# EAGLE schematic snowmaker_V1.0_for_eagle7.5 (EAGLE 7.7.0)

## Sheet 1 of 5: 主控、通讯部分
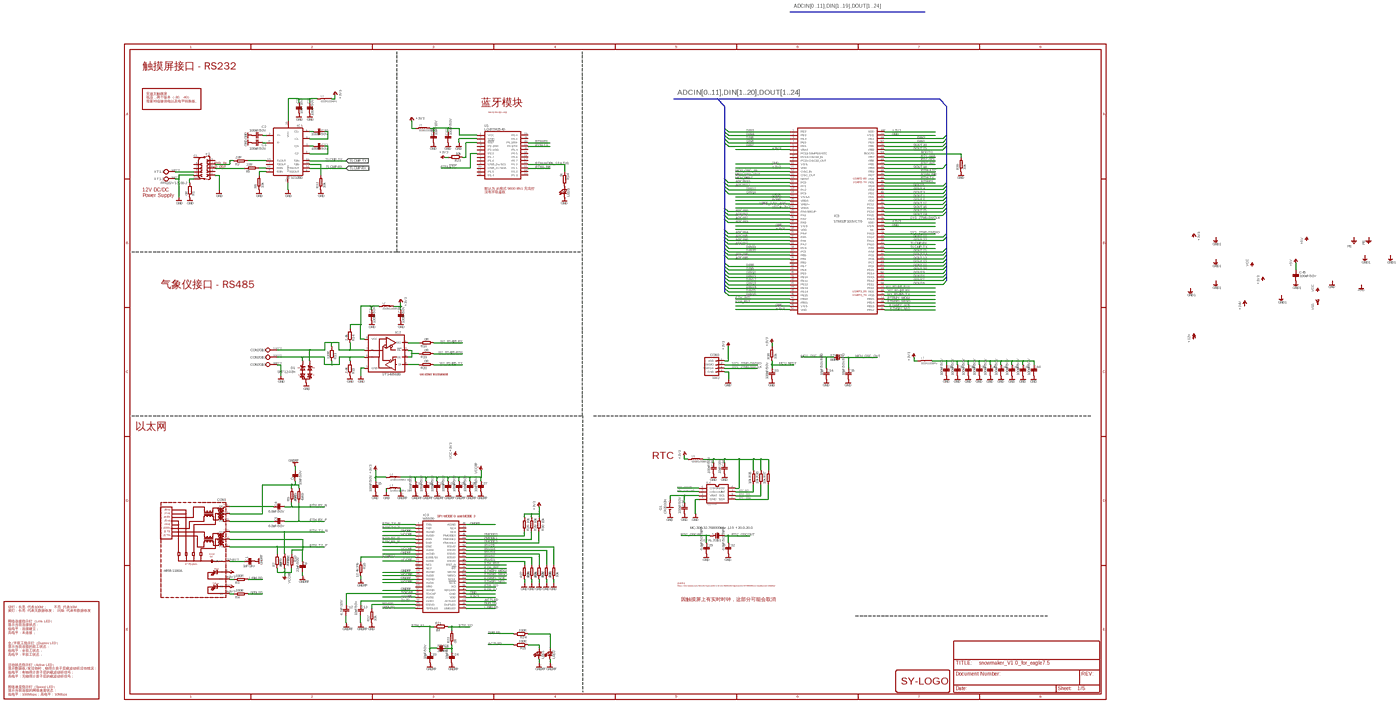
[diagram p0: schematic, sheet 1, overview]
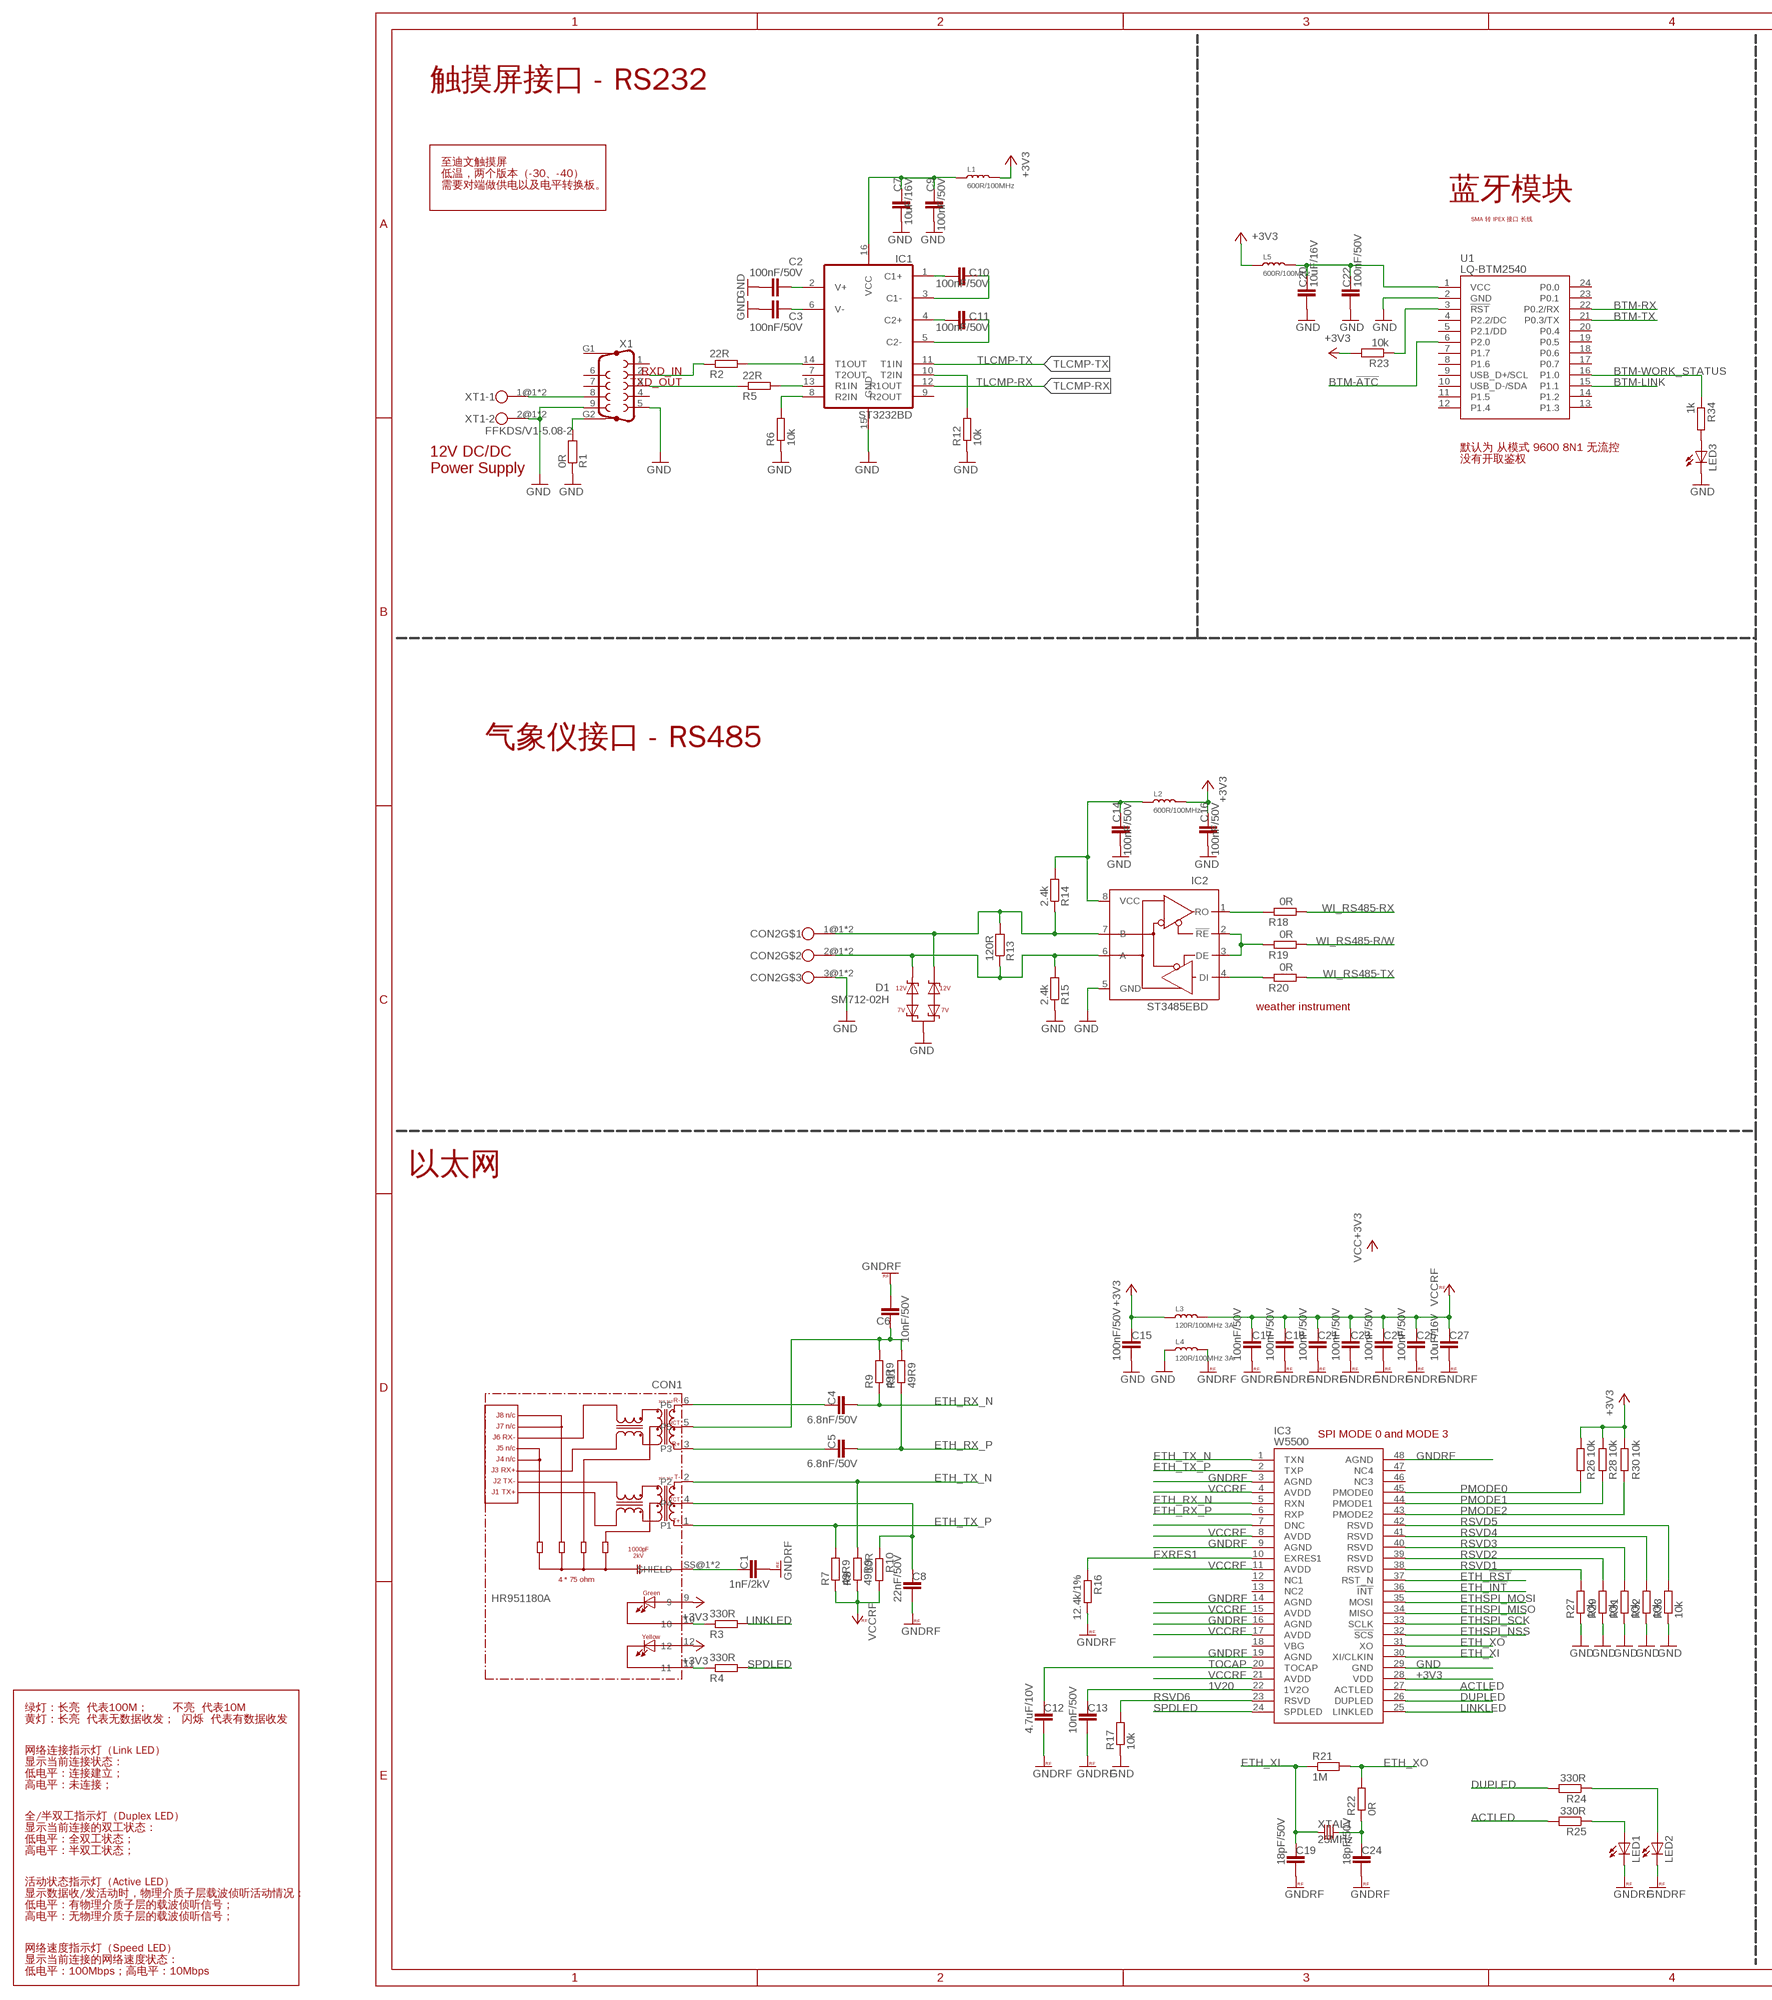
[diagram p1: schematic, sheet 1, part 1 of 4]
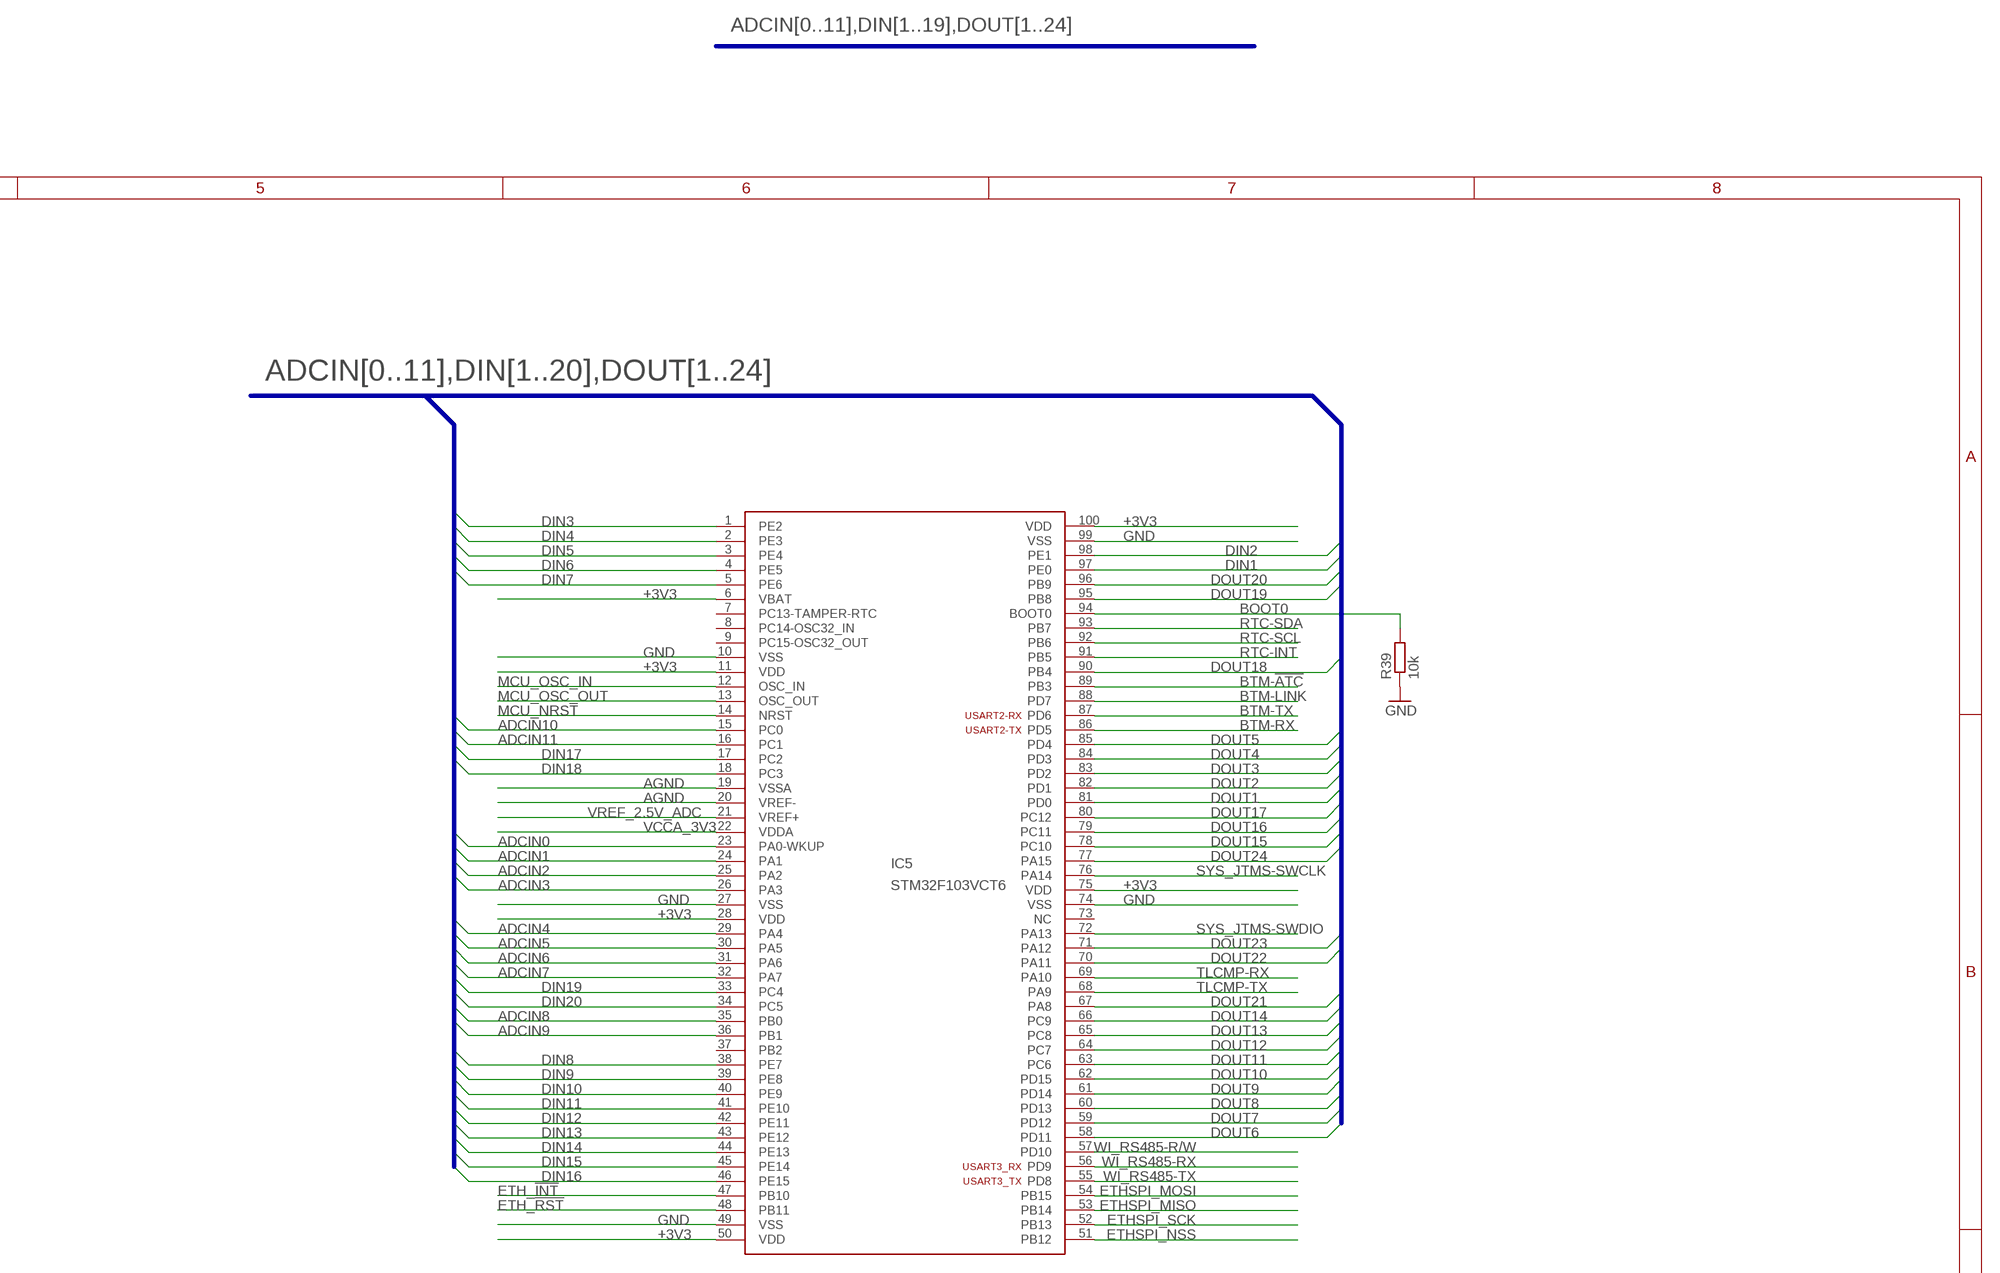
[diagram p2: schematic, sheet 1, part 2 of 4]
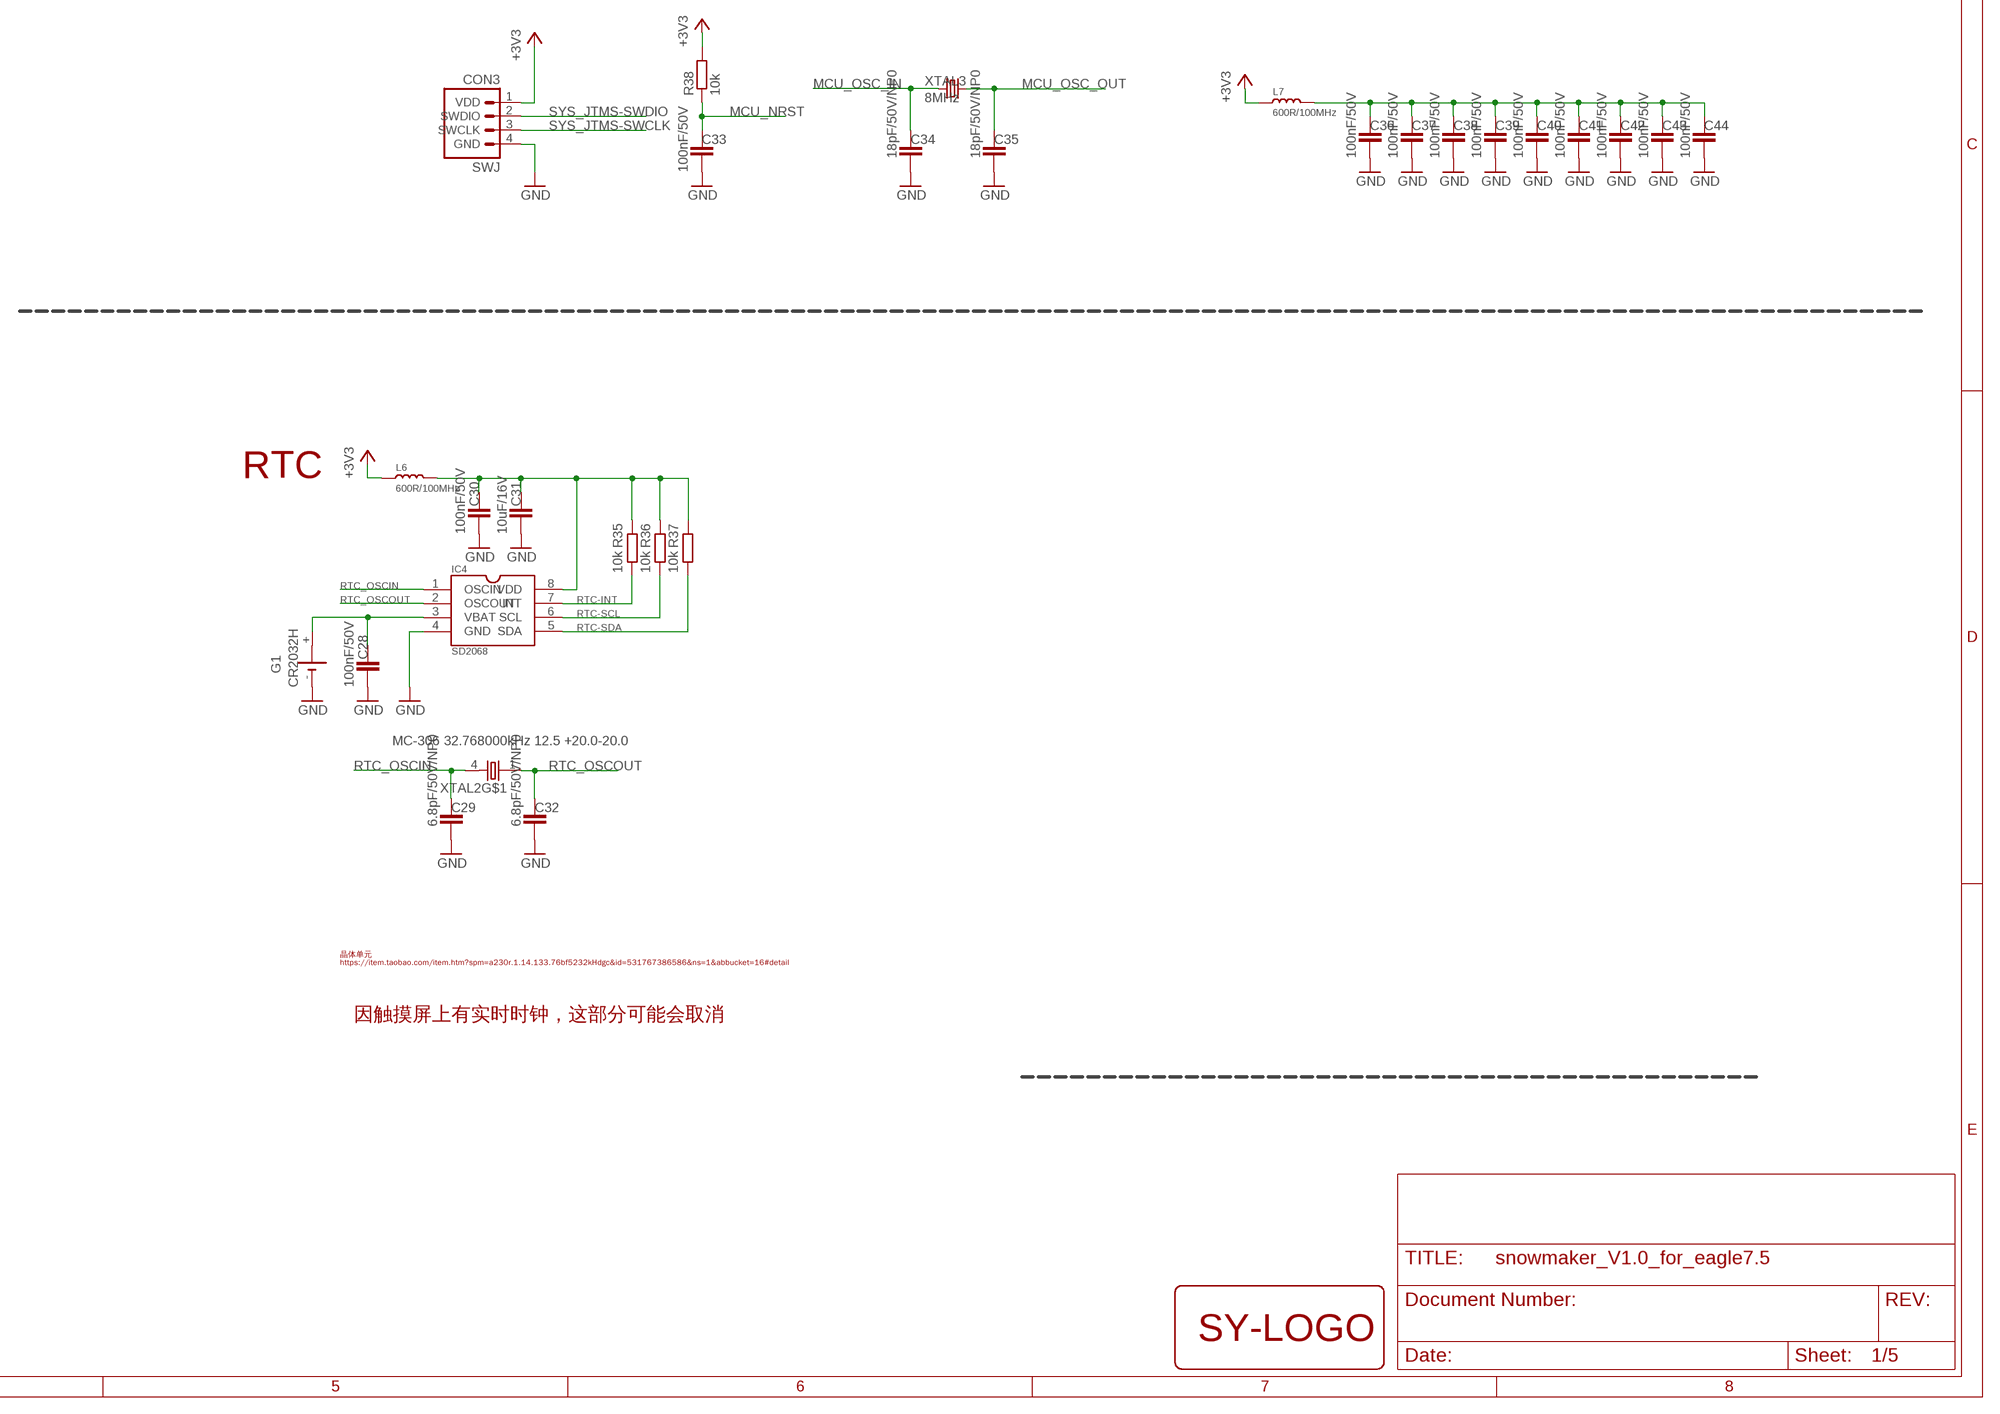
[diagram p3: schematic, sheet 1, part 3 of 4]
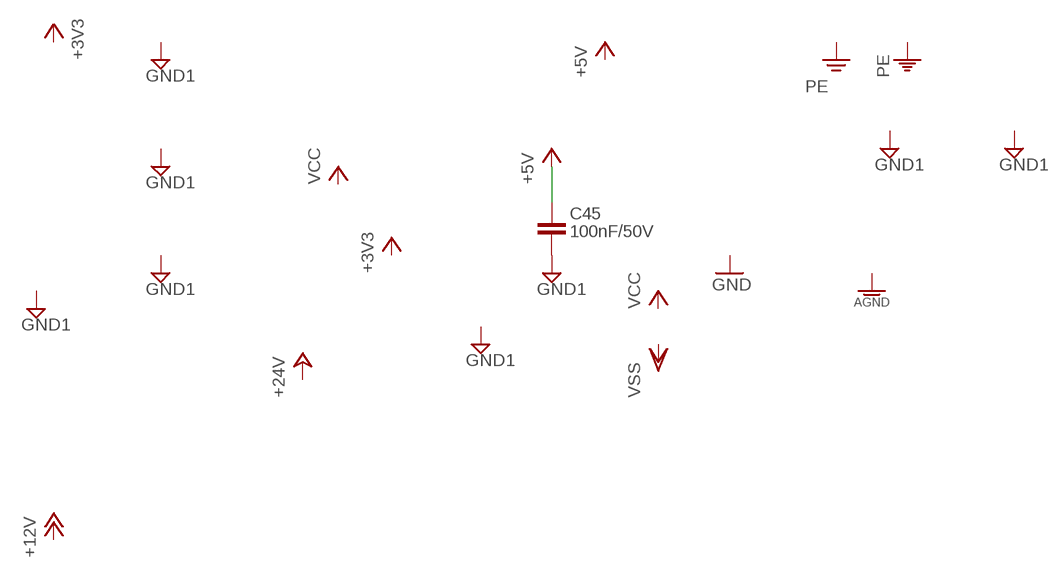
[diagram p4: schematic, sheet 1, part 4 of 4]

### Parts
C1  1nF/2kV  C1206  [C1206]
C2  100nF/50V  C0603  [C0603]
C3  100nF/50V  C0603  [C0603]
C4  6.8nF/50V  C0603  [C0603]
C5  6.8nF/50V  C0603  [C0603]
C6  10nF/50V  C0603  [C0603]
C7  10uF/16V  C0603  [C0603]
C8  22nF/50V  C0603  [C0603]
C9  100nF/50V  C0603  [C0603]
C10  100nF/50V  C0603  [C0603]
C11  100nF/50V  C0603  [C0603]
C12  4.7uF/10V  C0603  [C0603]
C13  10nF/50V  C0603  [C0603]
C14  100nF/50V  C0603  [C0603]
C15  100nF/50V  C0603  [C0603]
C16  100nF/50V  C0603  [C0603]
C17  100nF/50V  C0603  [C0603]
C18  100nF/50V  C0603  [C0603]
C19  18pF/50V  C0603  [C0603]
C20  10uF/16V  C0603  [C0603]
C21  100nF/50V  C0603  [C0603]
C22  100nF/50V  C0603  [C0603]
C23  100nF/50V  C0603  [C0603]
C24  18pF/50V  C0603  [C0603]
C25  100nF/50V  C0603  [C0603]
C26  100nF/50V  C0603  [C0603]
C27  10uF/16V  C0603  [C0603]
C28  100nF/50V  C0603  [C0603]
C29  6.8pF/50V/NP0  C0603  [C0603]
C30  100nF/50V  C0603  [C0603]
C31  10uF/16V  C0603  [C0603]
C32  6.8pF/50V/NP0  C0603  [C0603]
C33  100nF/50V  C0603  [C0603]
C34  18pF/50V/NP0  C0603  [C0603]
C35  18pF/50V/NP0  C0603  [C0603]
C36  100nF/50V  C0603  [C0603]
C37  100nF/50V  C0603  [C0603]
C38  100nF/50V  C0603  [C0603]
C39  100nF/50V  C0603  [C0603]
C40  100nF/50V  C0603  [C0603]
C41  100nF/50V  C0603  [C0603]
C42  100nF/50V  C0603  [C0603]
C43  100nF/50V  C0603  [C0603]
C44  100nF/50V  C0603  [C0603]
C45  100nF/50V  C0603  [C0603]
CON1  HR951180A  [HY951180A]
CON2  FFKDS/V1-5.08-3  [FFKDS/V1-5.08-3]
CON3  SWJ  [PINHEAD-4P]
D1  SM712-02H  [SOT23-3]
G1  CR2032H  [CR2032H]
IC1  ST3232BD  [SO16]
IC2  ST3485EBD  [SO08]
IC3  W5500  [LQFP48_7X7_0.5P]
IC4  SD2068  [SOIC-8]
IC5  STM32F103VCT6  [LQFP100_14X14MM]
L1  600R/100MHz  INDUCTOR/FERRITE-BEAD'0603'  [L0603]
L2  600R/100MHz  INDUCTOR/FERRITE-BEAD'0603'  [L0603]
L3  120R/100MHz 3A  INDUCTOR/FERRITE-BEAD'0603'  [L0603]
L4  120R/100MHz 3A  INDUCTOR/FERRITE-BEAD'0603'  [L0603]
L5  600R/100MHz  INDUCTOR/FERRITE-BEAD'0603'  [L0603]
L6  600R/100MHz  INDUCTOR/FERRITE-BEAD'0603'  [L0603]
L7  600R/100MHz  INDUCTOR/FERRITE-BEAD'0603'  [L0603]
LED1  LEDSML0805  [SML0805]
LED2  LEDSML0805  [SML0805]
LED3  LED0805  [LED0805]
LOGO1  SY-LOGO_BOTTOM  [SY-LOGO_BOTTOM]
R1  0R  R1206  [R1206]
R2  22R  R0603  [R0603]
R3  330R  R0603  [R0603]
R4  330R  R0603  [R0603]
R5  22R  R0603  [R0603]
R6  10k  R0603  [R0603]
R7  49R9  R0603  [R0603]
R8  49R9  R0603  [R0603]
R9  49R9  R0603  [R0603]
R10  10R  R0603  [R0603]
R11  49R9  R0603  [R0603]
R12  10k  R0603  [R0603]
R13  120R  R1206  [R1206]
R14  2.4k  R1206  [R1206]
R15  2.4k  R1206  [R1206]
R16  12.4k/1%  R0603  [R0603]
R17  10k  R0603  [R0603]
R18  0R  R0603  [R0603]
R19  0R  R0603  [R0603]
R20  0R  R0603  [R0603]
R21  1M  R0603  [R0603]
R22  0R  R0603  [R0603]
R23  10k  R0603  [R0603]
R24  330R  R0603  [R0603]
R25  330R  R0603  [R0603]
R26  10k  R0603  [R0603]
R27  10k  R0603  [R0603]
R28  10k  R0603  [R0603]
R29  10k  R0603  [R0603]
R30  10k  R0603  [R0603]
R31  10k  R0603  [R0603]
R32  10k  R0603  [R0603]
R33  10k  R0603  [R0603]
R34  1k  R0603  [R0603]
R35  10k  R0603  [R0603]
R36  10k  R0603  [R0603]
R37  10k  R0603  [R0603]
R38  10k  R0603  [R0603]
R39  10k  R0603  [R0603]
U1  LQ-BTM2540  [LQ-BTM2540]
X1  F09VP  [F09VP]
XT1  FFKDS/V1-5.08-2  [FFKDS/V1-5.08-2]
XTAL1  25MHz  CRYSTALSM49  [SM49]
XTAL2  MC-306 32.768000kHz 12.5 +20.0-20.0  MC-306  [MC306]
XTAL3  8MHz  CRYSTALSM49  [SM49]

### Nets
1V20: C13.1 IC3.22(1V2O)
+3V3: C15.1 C16.1 CON1.9 CON1.12 CON3.1(VDD) IC3.28(VDD) IC5.6(VBAT) IC5.11(VDD) IC5.28(VDD) IC5.50(VDD) IC5.75(VDD) IC5.100(VDD) L1.2 L2.2 L3.1 L5.1 L6.1 L7.1 R23.2 R26.2 R28.2 R30.2 R38.2 ; also sheet 3
+5V: C45.1
ACTLED: IC3.27(ACTLED) R25.2
ADCIN0: IC5.23(PA0-WKUP) ; also sheet 4
ADCIN1: IC5.24(PA1) ; also sheet 4
ADCIN2: IC5.25(PA2) ; also sheet 4
ADCIN3: IC5.26(PA3) ; also sheet 4
ADCIN4: IC5.29(PA4) ; also sheet 4
ADCIN5: IC5.30(PA5) ; also sheet 4
ADCIN6: IC5.31(PA6) ; also sheet 4
ADCIN7: IC5.32(PA7) ; also sheet 4
ADCIN8: IC5.35(PB0) ; also sheet 4
ADCIN9: IC5.36(PB1) ; also sheet 4
ADCIN10: IC5.15(PC0) ; also sheet 4
ADCIN11: IC5.16(PC1) ; also sheet 4
AGND: IC5.19(VSSA) IC5.20(VREF-) ; also sheet 4
BOOT0: IC5.94(BOOT0) R39.2
BTM-!ATC: IC5.89(PB3) U1.6(P2.0)
BTM-LINK: IC5.88(PD7) U1.15(P1.1)
BTM-RX: IC5.86(PD5) U1.22(P0.2/RX)
BTM-TX: IC5.87(PD6) U1.21(P0.3/TX)
BTM-WORK_STATUS: R34.1 U1.16(P1.0)
DIN1: IC5.97(PE0) ; also sheet 3
DIN2: IC5.98(PE1) ; also sheet 3
DIN3: IC5.1(PE2) ; also sheet 3
DIN4: IC5.2(PE3) ; also sheet 3
DIN5: IC5.3(PE4) ; also sheet 3
DIN6: IC5.4(PE5) ; also sheet 3
DIN7: IC5.5(PE6) ; also sheet 3
DIN8: IC5.38(PE7) ; also sheet 3
DIN9: IC5.39(PE8) ; also sheet 3
DIN10: IC5.40(PE9) ; also sheet 3
DIN11: IC5.41(PE10) ; also sheet 3
DIN12: IC5.42(PE11) ; also sheet 3
DIN13: IC5.43(PE12) ; also sheet 3
DIN14: IC5.44(PE13) ; also sheet 3
DIN15: IC5.45(PE14) ; also sheet 3
DIN16: IC5.46(PE15) ; also sheet 3
DIN17: IC5.17(PC2) ; also sheet 3
DIN18: IC5.18(PC3) ; also sheet 3
DIN19: IC5.33(PC4) ; also sheet 3
DIN20: IC5.34(PC5) ; also sheet 3
DOUT1: IC5.81(PD0) ; also sheet 2
DOUT2: IC5.82(PD1) ; also sheet 2
DOUT3: IC5.83(PD2) ; also sheet 2
DOUT4: IC5.84(PD3) ; also sheet 2
DOUT5: IC5.85(PD4) ; also sheet 2
DOUT6: IC5.58(PD11) ; also sheet 2
DOUT7: IC5.59(PD12) ; also sheet 2
DOUT8: IC5.60(PD13) ; also sheet 2
DOUT9: IC5.61(PD14) ; also sheet 2
DOUT10: IC5.62(PD15) ; also sheet 2
DOUT11: IC5.63(PC6) ; also sheet 2
DOUT12: IC5.64(PC7) ; also sheet 2
DOUT13: IC5.65(PC8) ; also sheet 2
DOUT14: IC5.66(PC9) ; also sheet 2
DOUT15: IC5.78(PC10) ; also sheet 2
DOUT16: IC5.79(PC11) ; also sheet 2
DOUT17: IC5.80(PC12) ; also sheet 2
DOUT18: IC5.90(PB4) ; also sheet 2
DOUT19: IC5.95(PB8) ; also sheet 2
DOUT20: IC5.96(PB9) ; also sheet 2
DOUT21: IC5.67(PA8) ; also sheet 2
DOUT22: IC5.70(PA11) ; also sheet 2
DOUT23: IC5.71(PA12) ; also sheet 2
DOUT24: IC5.77(PA15) ; also sheet 2
DUPLED: IC3.26(DUPLED) R24.2
ETH_!INT: IC3.36(!INT) IC5.47(PB10)
ETH_!RST: IC3.37(RST_N) IC5.48(PB11)
ETH_RX_N: C4.2 IC3.5(RXN) R9.1
ETH_RX_P: C5.2 IC3.6(RXP) R11.1
ETH_RXC_N: C4.1 CON1.6
ETH_RXC_P: C5.1 CON1.3
ETH_TX_N: CON1.2 IC3.1(TXN) R8.2
ETH_TX_P: CON1.1 IC3.2(TXP) R7.2
ETH_XI: C19.1 IC3.30(XI/CLKIN) R21.1 XTAL1.1
ETH_XO: IC3.31(XO) R21.2 R22.2
ETHSPI_MISO: IC3.34(MISO) IC5.53(PB14)
ETHSPI_MOSI: IC3.35(MOSI) IC5.54(PB15)
ETHSPI_NSS: IC3.32(!SCS) IC5.51(PB12)
ETHSPI_SCK: IC3.33(SCLK) IC5.52(PB13)
EXRES1: IC3.10(EXRES1) R16.1
GND: C2.2 C3.2 C7.2 C9.2 C14.2 C15.2 C16.2 C20.2 C22.2 C28.2 C29.2 C30.2 C31.2 C32.2 C33.2 C34.2 C35.2 C36.2 C37.2 C38.2 C39.2 C40.2 C41.2 C42.2 C43.2 C44.2 CON2.3@1 CON2.3@2 CON3.4(GND) D1.3 G1.- IC1.15(GND) IC2.5(GND) IC3.29(GND) IC4.4(GND) IC5.10(VSS) IC5.27(VSS) IC5.49(VSS) IC5.74(VSS) IC5.99(VSS) L4.1 LED3.C R1.1 R6.1 R12.1 R15.1 R17.1 R27.1 R29.1 R31.1 R32.1 R33.1 R39.1 U1.2(GND) X1.5 X1.9 XT1.2@1 XT1.2@2 ; also sheet 2,3,4
GND1: C45.2 ; also sheet 2
GNDRF: C1.2 C6.2 C8.2 C12.2 C13.2 C17.2 C18.2 C19.2 C21.2 C23.2 C24.2 C25.2 C26.2 C27.2 IC3.3(AGND) IC3.9(AGND) IC3.14(AGND) IC3.16(AGND) IC3.19(AGND) IC3.48(AGND) L4.2 LED1.C LED2.C R16.2
LINKLED: IC3.25(LINKLED) R3.2
MCU_NRST: C33.1 IC5.14(NRST) R38.1
MCU_OSC_IN: C34.1 IC5.12(OSC_IN) XTAL3.1
MCU_OSC_OUT: C35.1 IC5.13(OSC_OUT) XTAL3.2
N$169: C24.1 R22.1 XTAL1.2
N$170: CON1.10 R3.1
N$171: C10.2 IC1.1(C1+)
N$172: C11.2 IC1.4(C2+)
N$173: C2.1 IC1.2(V+)
N$174: C3.1 IC1.6(V-)
N$175: C10.1 IC1.3(C1-)
N$176: C11.1 IC1.5(C2-)
N$177: IC2.4(DI) R20.1
N$178: CON1.11 R4.1
N$179: IC1.10(T2IN) R12.2
N$180: IC2.2(!RE) IC2.3(DE) R19.1
N$197: CON2.2@1 CON2.2@2 D1.1 IC2.6(A) R13.1 R15.2
N$198: IC1.14(T1OUT) R2.2
N$199: R2.1 X1.2
N$200: C1.1 CON1.SS@1(SHIELD) CON1.SS@2(SHIELD)
N$217: C8.1 CON1.4 R10.1
N$218: C6.1 CON1.5 R9.2 R11.2
N$219: CON2.1@1 CON2.1@2 D1.2 IC2.7(B) R13.2 R14.1
N$220: R5.1 X1.3
N$222: IC3.7(DNC)
N$224: LED1.A R25.1
N$225: LED2.A R24.1
N$226: IC1.13(R1IN) R5.2
N$227: IC1.8(R2IN) R6.2
N$295: LED3.A R34.2
N$296: C28.1 G1.+ IC4.3(VBAT)
N$297: R23.1 U1.3(!RST)
N$298: C7.1 C9.1 IC1.16(VCC) L1.1
N$299: C20.1 C22.1 L5.2 U1.1(VCC)
N$300: C36.1 C37.1 C38.1 C39.1 C40.1 C41.1 C42.1 C43.1 C44.1 L7.2
N$301: C14.1 IC2.8(VCC) L2.1 R14.2
N$302: R1.2 X1.G2
N$303: C30.1 C31.1 IC4.8(VDD) L6.2 R35.1 R36.1 R37.1
N$304: X1.8 XT1.1@1 XT1.1@2
PMODE0: IC3.45(PMODE0) R26.1
PMODE1: IC3.44(PMODE1) R28.1
PMODE2: IC3.43(PMODE2) R30.1
RSVD1: IC3.38(RSVD) R27.2
RSVD2: IC3.39(RSVD) R29.2
RSVD3: IC3.40(RSVD) R31.2
RSVD4: IC3.41(RSVD) R32.2
RSVD5: IC3.42(RSVD) R33.2
RSVD6: IC3.23(RSVD) R17.2
RTC-INT: IC4.7(INT) IC5.91(PB5) R35.2
RTC-SCL: IC4.6(SCL) IC5.92(PB6) R36.2
RTC-SDA: IC4.5(SDA) IC5.93(PB7) R37.2
RTC_OSCIN: C29.1 IC4.1(OSCIN) XTAL2.4
RTC_OSCOUT: C32.1 IC4.2(OSCOUT) XTAL2.1
RX-485: IC2.1(RO) R18.1
SPDLED: IC3.24(SPDLED) R4.2
SYS_JTMS-SWCLK: CON3.3(SWCLK) IC5.76(PA14)
SYS_JTMS-SWDIO: CON3.2(SWDIO) IC5.72(PA13)
TLCMP-RX: IC1.12(R1OUT) IC5.69(PA10)
TLCMP-TX: IC1.11(T1IN) IC5.68(PA9)
TOCAP: C12.1 IC3.20(TOCAP)
VCCA_3V3: IC5.22(VDDA) ; also sheet 4
VCCRF: C17.1 C18.1 C21.1 C23.1 C25.1 C26.1 C27.1 IC3.4(AVDD) IC3.8(AVDD) IC3.11(AVDD) IC3.15(AVDD) IC3.17(AVDD) IC3.21(AVDD) L3.2 R7.1 R8.1 R10.2
VREF_2.5V_ADC: IC5.21(VREF+) ; also sheet 4
WI_RS485-R/W: IC5.57(PD10) R19.2
WI_RS485-RX: IC5.56(PD9) R18.2
WI_RS485-TX: IC5.55(PD8) R20.2
Unconnected: G1.+@1(+) IC1.7(T2OUT) IC1.9(R2OUT) IC3.12(NC1) IC3.13(NC2) IC3.18(VBG) IC3.46(NC3) IC3.47(NC4) IC5.7(PC13-TAMPER-RTC) IC5.8(PC14-OSC32_IN) IC5.9(PC15-OSC32_OUT) IC5.37(PB2) IC5.73(NC) U1.4(P2.2/DC) U1.5(P2.1/DD) U1.7(P1.7) U1.8(P1.6) U1.9(USB_D+/SCL) U1.10(USB_D-/SDA) U1.11(P1.5) U1.12(P1.4) U1.13(P1.3) U1.14(P1.2) U1.17(P0.7) U1.18(P0.6) U1.19(P0.5) U1.20(P0.4) U1.23(P0.1) U1.24(P0.0) X1.1 X1.4 X1.6 X1.7 X1.G1 XTAL2.2 XTAL2.3

### Buses
ADCIN[0..11],DIN[1..19],DOUT[1..24]
ADCIN[0..11],DIN[1..20],DOUT[1..24]

### Notes on the sheet
- 触摸屏接口 - RS232
- 至迪文触摸屏
  低温，两个版本（-30、-40）
  需要对端做供电以及电平转换板。
- 蓝牙模块
- SMA 转 IPEX 接口 长线
- RXD_IN
- TXD_OUT
- USART2-RX
- USART2-TX
- 默认为 从模式 9600 8N1 无流控
  没有开取鉴权
- 12V DC/DC
  Power Supply
- 气象仪接口 - RS485
- USART3_RX
- USART3_TX
- weather instrument
- 以太网
- RTC
- SPI MODE 0 and MODE 3
- 晶体单元
  https://item.taobao.com/item.htm?spm=a230r.1.14.133.76bf5232kHdgc&id=531767386586&ns=1&abbucket=16#detail
- 因触摸屏上有实时时钟，这部分可能会取消
- 绿灯：长亮  代表100M；       不亮  代表10M
  黄灯：长亮  代表无数据收发；  闪烁  代表有数据收发
- 网络连接指示灯（Link LED） 
  显示当前连接状态： 
  低电平：连接建立； 
  高电平：未连接；
- 全/半双工指示灯（Duplex LED） 
  显示当前连接的双工状态： 
  低电平：全双工状态； 
  高电平：半双工状态；
- 活动状态指示灯（Active LED） 
  显示数据收/发活动时，物理介质子层载波侦听活动情况： 
  低电平：有物理介质子层的载波侦听信号； 
  高电平：无物理介质子层的载波侦听信号；
- 网络速度指示灯（Speed LED） 
  显示当前连接的网络速度状态： 
  低电平：100Mbps；高电平：10Mbps

## Sheet 2 of 5: 24 路继电器输出
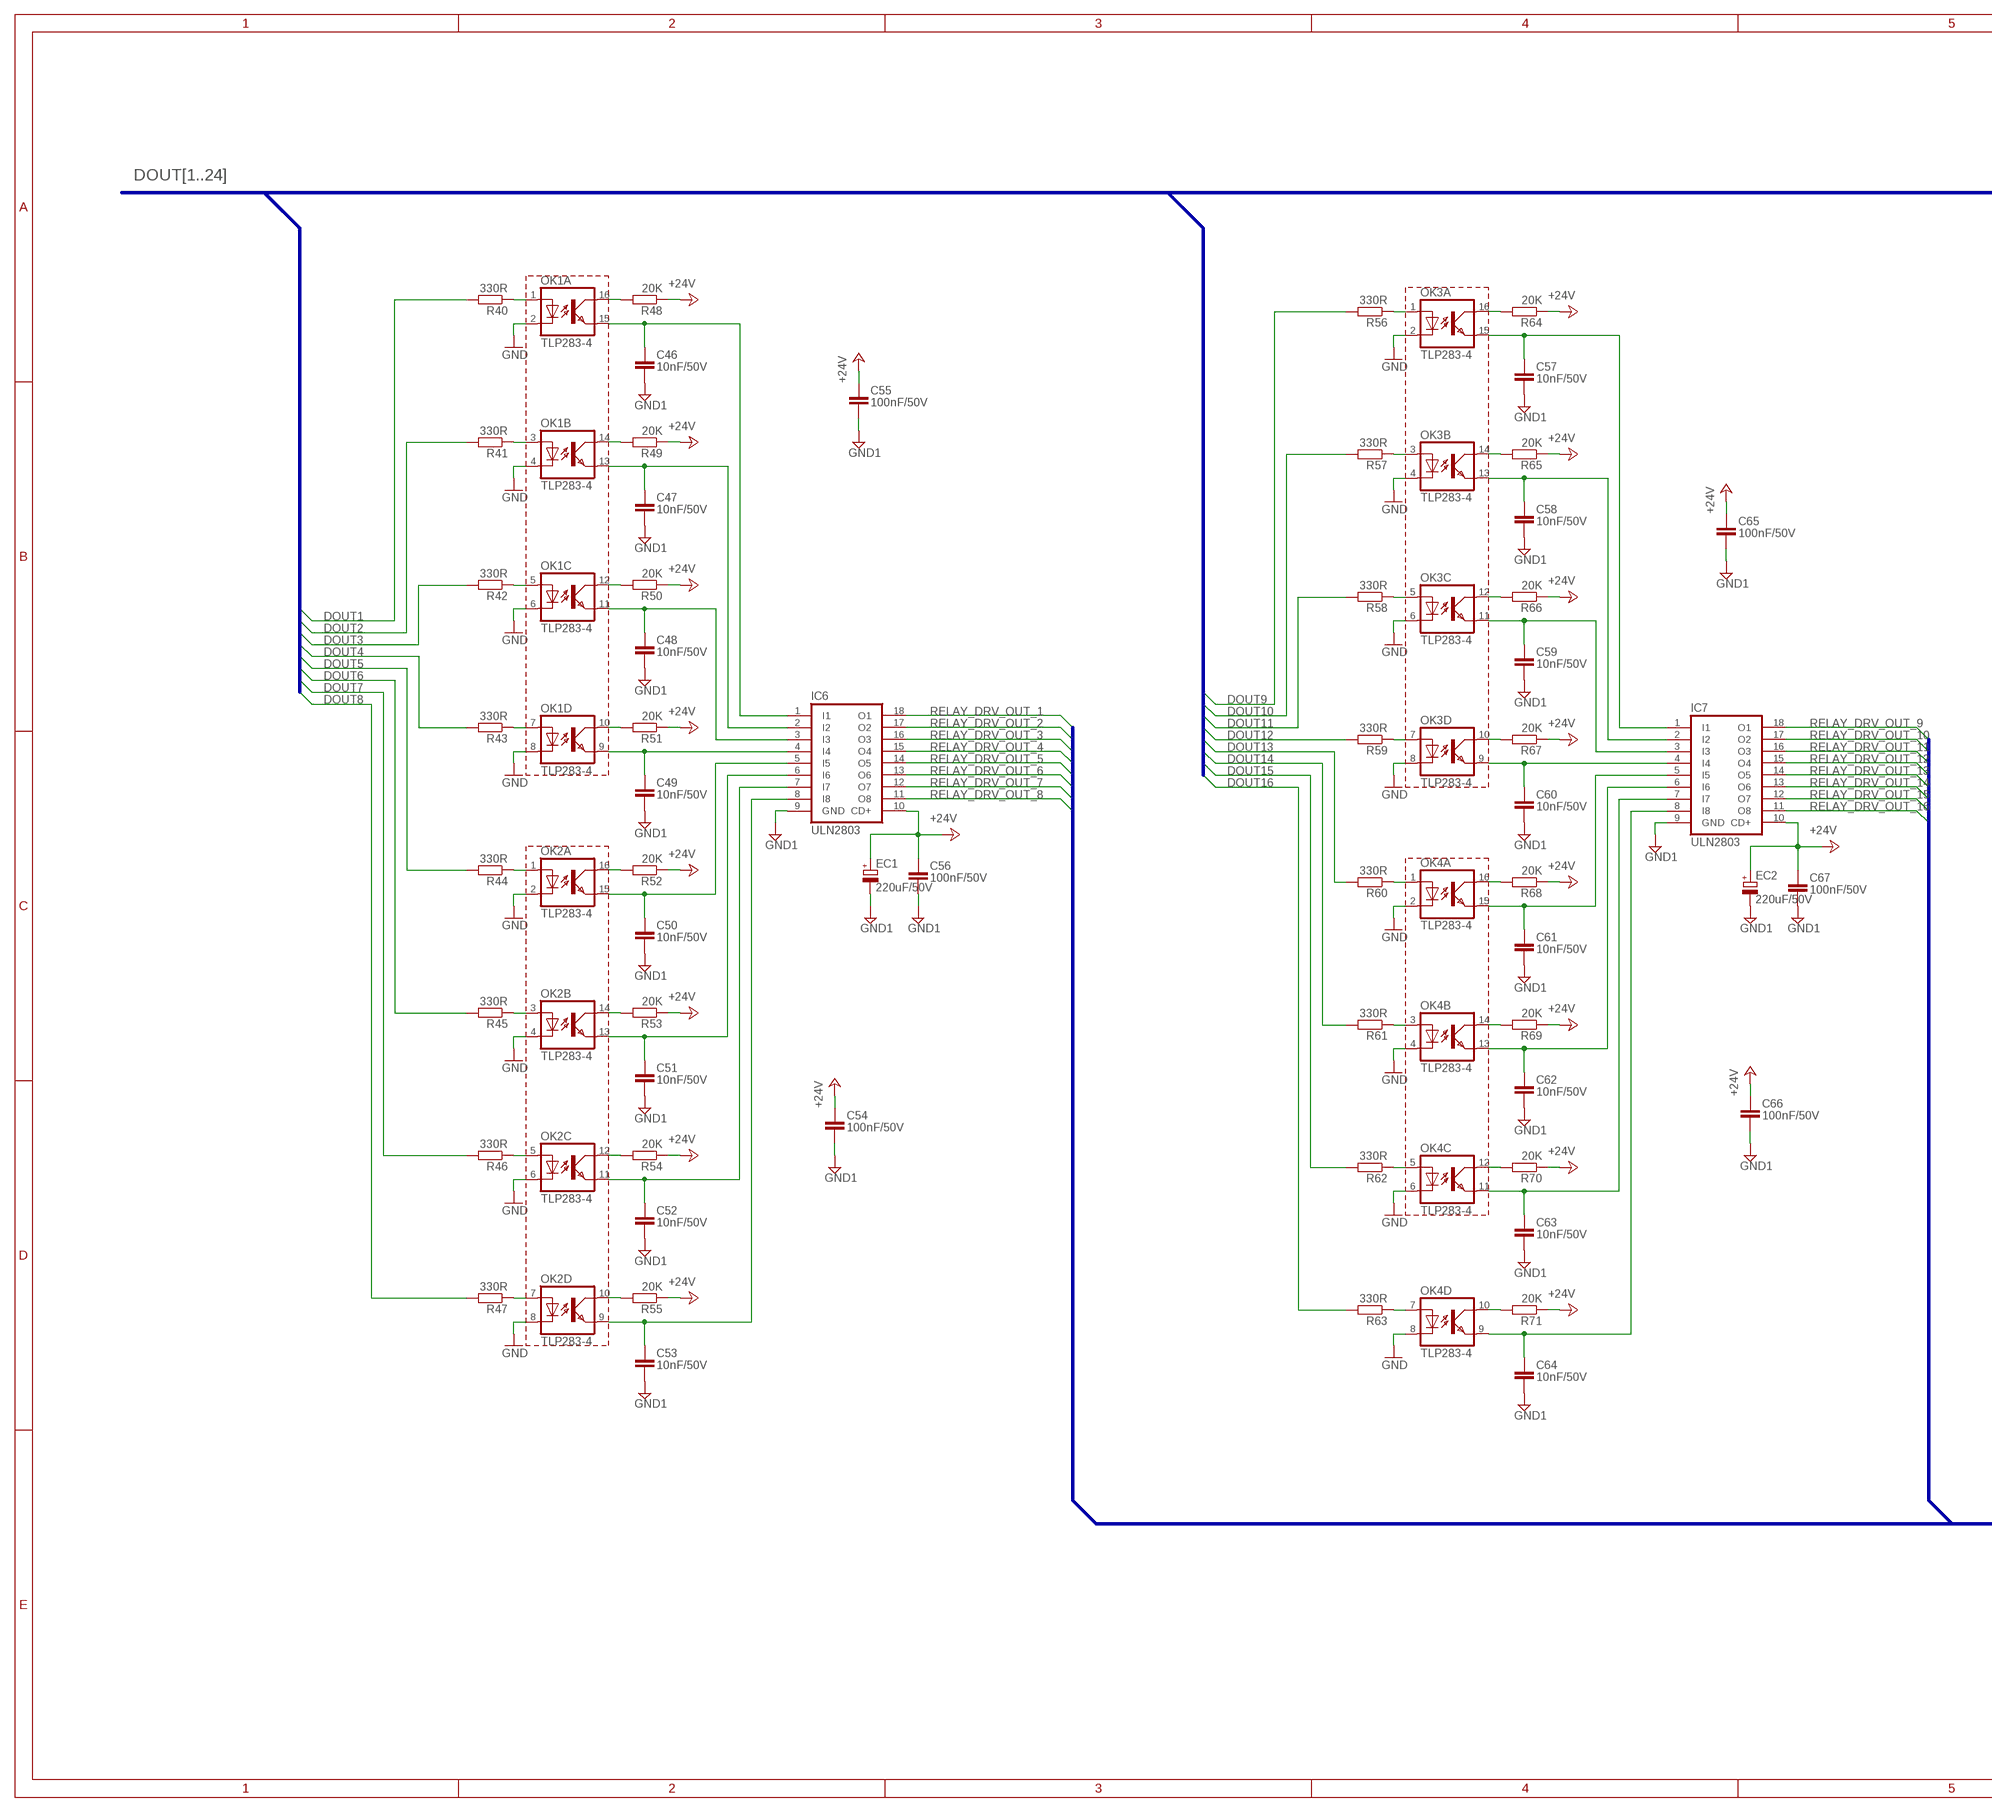
[diagram p5: schematic, sheet 2, part 1 of 2]
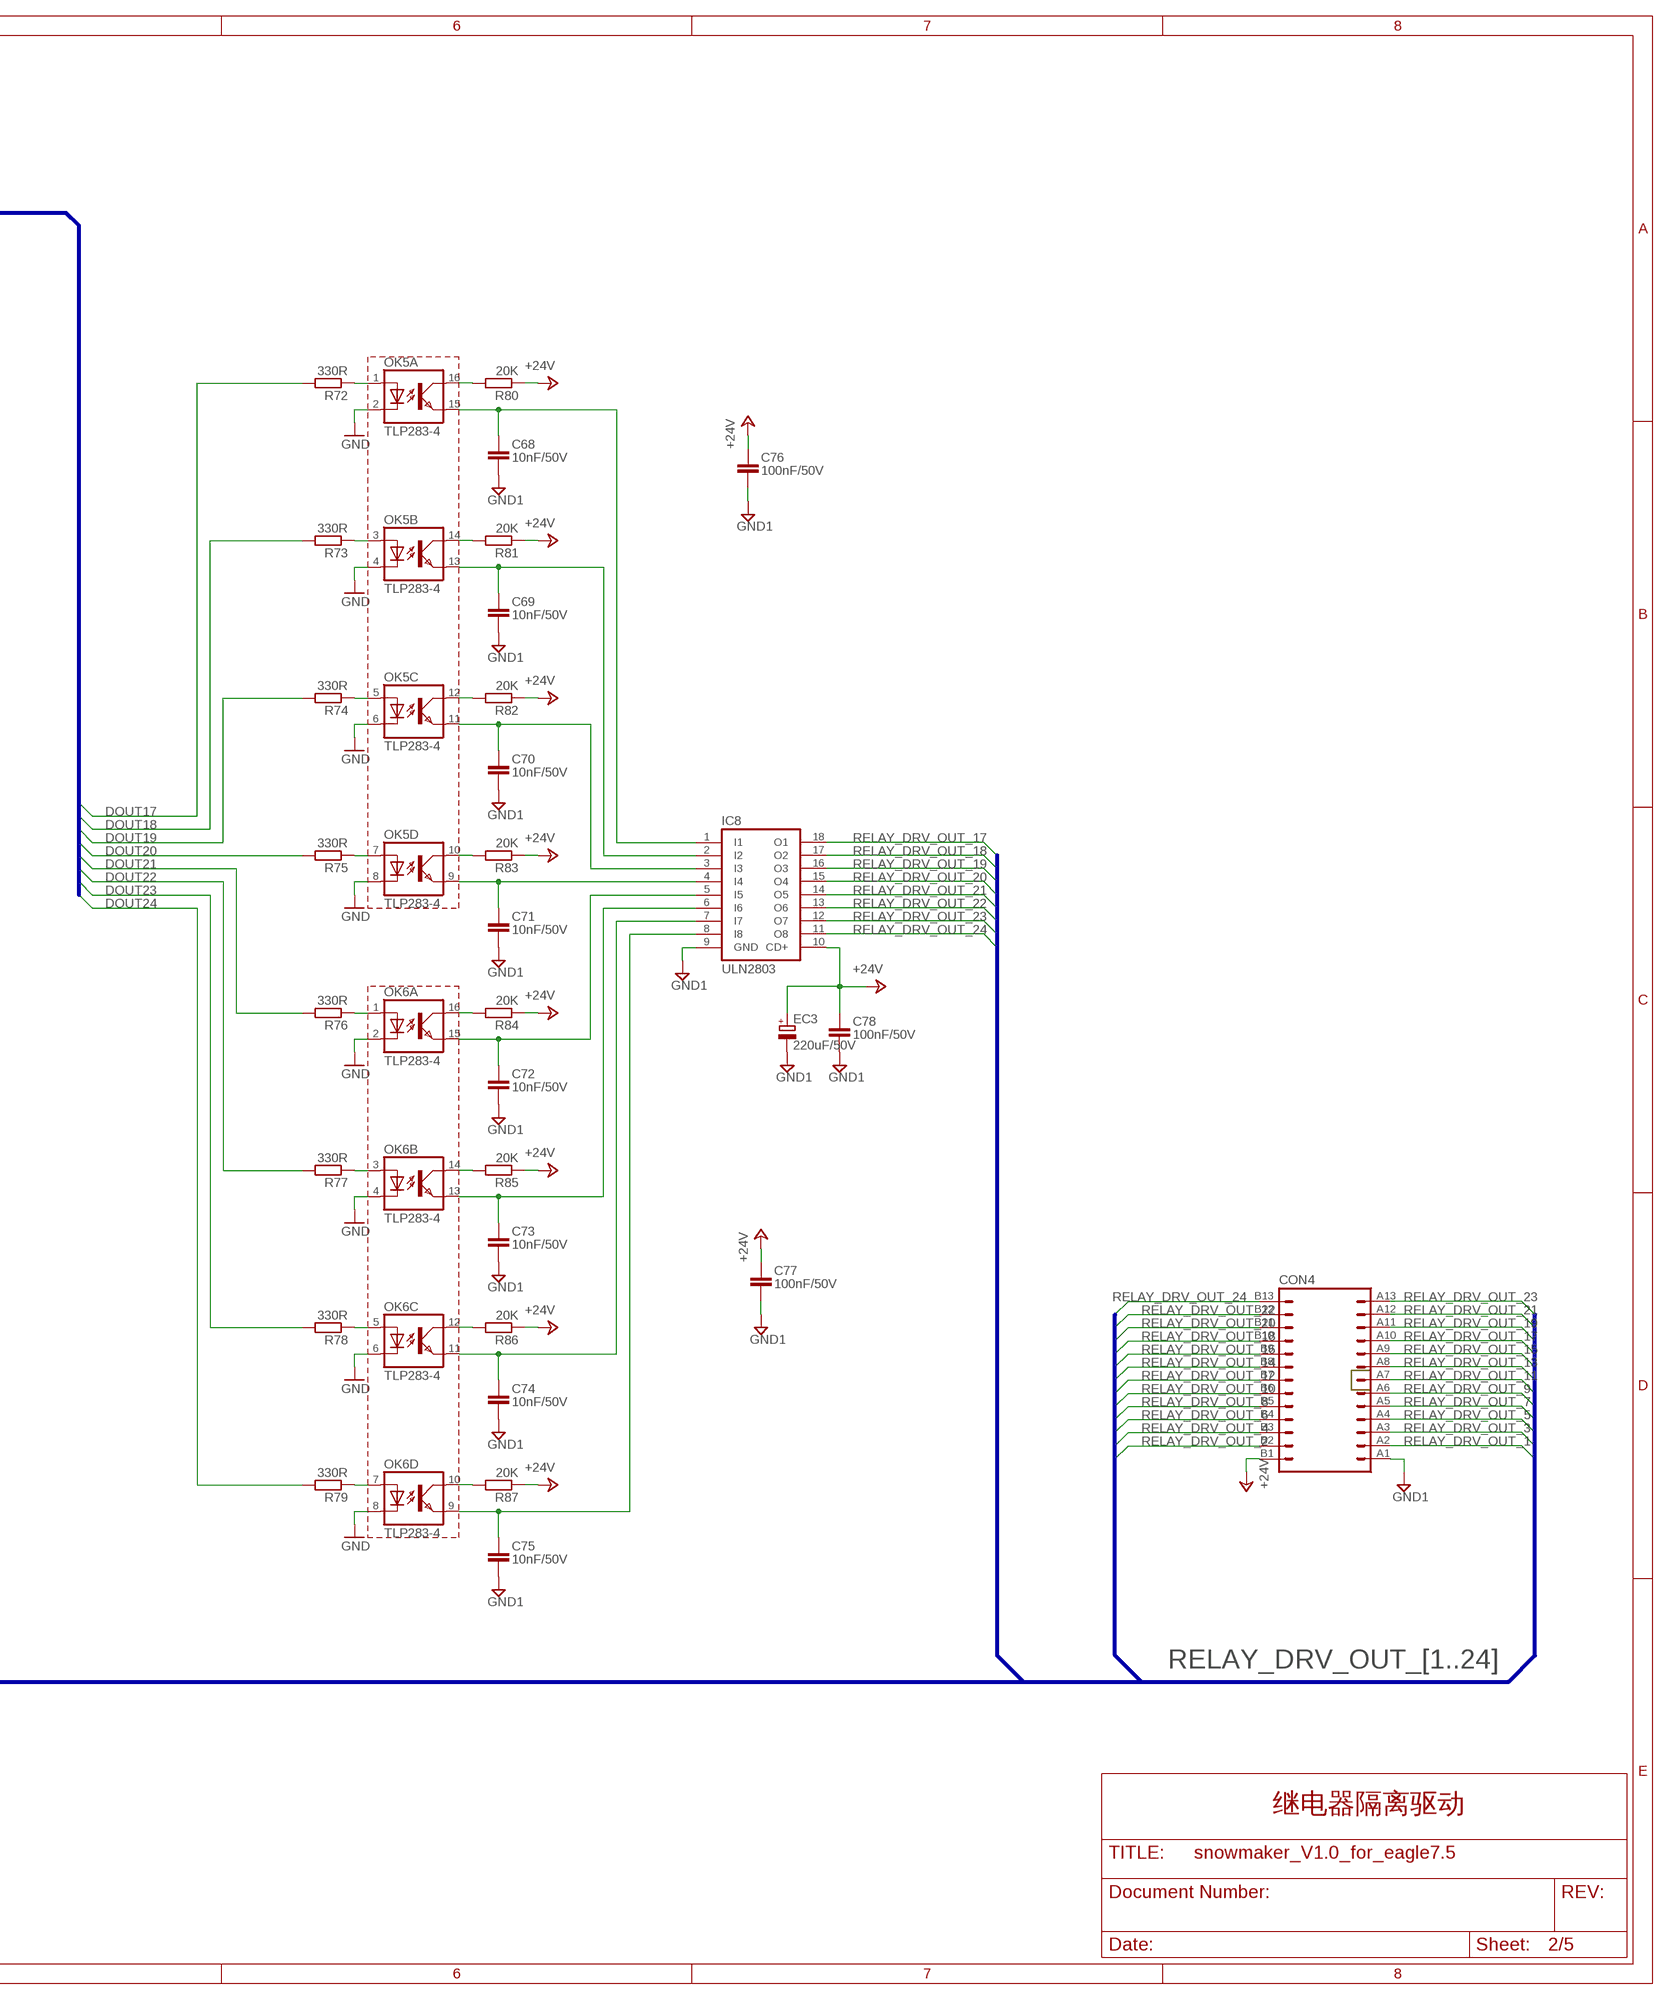
[diagram p6: schematic, sheet 2, part 2 of 2]

### Parts
C46  10nF/50V  C0603  [C0603]
C47  10nF/50V  C0603  [C0603]
C48  10nF/50V  C0603  [C0603]
C49  10nF/50V  C0603  [C0603]
C50  10nF/50V  C0603  [C0603]
C51  10nF/50V  C0603  [C0603]
C52  10nF/50V  C0603  [C0603]
C53  10nF/50V  C0603  [C0603]
C54  100nF/50V  C0603  [C0603]
C55  100nF/50V  C0603  [C0603]
C56  100nF/50V  C0603  [C0603]
C57  10nF/50V  C0603  [C0603]
C58  10nF/50V  C0603  [C0603]
C59  10nF/50V  C0603  [C0603]
C60  10nF/50V  C0603  [C0603]
C61  10nF/50V  C0603  [C0603]
C62  10nF/50V  C0603  [C0603]
C63  10nF/50V  C0603  [C0603]
C64  10nF/50V  C0603  [C0603]
C65  100nF/50V  C0603  [C0603]
C66  100nF/50V  C0603  [C0603]
C67  100nF/50V  C0603  [C0603]
C68  10nF/50V  C0603  [C0603]
C69  10nF/50V  C0603  [C0603]
C70  10nF/50V  C0603  [C0603]
C71  10nF/50V  C0603  [C0603]
C72  10nF/50V  C0603  [C0603]
C73  10nF/50V  C0603  [C0603]
C74  10nF/50V  C0603  [C0603]
C75  10nF/50V  C0603  [C0603]
C76  100nF/50V  C0603  [C0603]
C77  100nF/50V  C0603  [C0603]
C78  100nF/50V  C0603  [C0603]
CON4  CON-HARTING-26V  [26V]
EC1  220uF/50V  CPOLUD-8X10  [UD-8X10_NICHICON]
EC2  220uF/50V  CPOLUD-8X10  [UD-8X10_NICHICON]
EC3  220uF/50V  CPOLUD-8X10  [UD-8X10_NICHICON]
IC6  ULN2803  ULN2803A-SO18W  [SO18W]
IC7  ULN2803  ULN2803A-SO18W  [SO18W]
IC8  ULN2803  ULN2803A-SO18W  [SO18W]
OK1  TLP283-4  [MINI-FLAT-16]
OK2  TLP283-4  [MINI-FLAT-16]
OK3  TLP283-4  [MINI-FLAT-16]
OK4  TLP283-4  [MINI-FLAT-16]
OK5  TLP283-4  [MINI-FLAT-16]
OK6  TLP283-4  [MINI-FLAT-16]
R40  330R  R0603  [R0603]
R41  330R  R0603  [R0603]
R42  330R  R0603  [R0603]
R43  330R  R0603  [R0603]
R44  330R  R0603  [R0603]
R45  330R  R0603  [R0603]
R46  330R  R0603  [R0603]
R47  330R  R0603  [R0603]
R48  20K  R0603  [R0603]
R49  20K  R0603  [R0603]
R50  20K  R0603  [R0603]
R51  20K  R0603  [R0603]
R52  20K  R0603  [R0603]
R53  20K  R0603  [R0603]
R54  20K  R0603  [R0603]
R55  20K  R0603  [R0603]
R56  330R  R0603  [R0603]
R57  330R  R0603  [R0603]
R58  330R  R0603  [R0603]
R59  330R  R0603  [R0603]
R60  330R  R0603  [R0603]
R61  330R  R0603  [R0603]
R62  330R  R0603  [R0603]
R63  330R  R0603  [R0603]
R64  20K  R0603  [R0603]
R65  20K  R0603  [R0603]
R66  20K  R0603  [R0603]
R67  20K  R0603  [R0603]
R68  20K  R0603  [R0603]
R69  20K  R0603  [R0603]
R70  20K  R0603  [R0603]
R71  20K  R0603  [R0603]
R72  330R  R0603  [R0603]
R73  330R  R0603  [R0603]
R74  330R  R0603  [R0603]
R75  330R  R0603  [R0603]
R76  330R  R0603  [R0603]
R77  330R  R0603  [R0603]
R78  330R  R0603  [R0603]
R79  330R  R0603  [R0603]
R80  20K  R0603  [R0603]
R81  20K  R0603  [R0603]
R82  20K  R0603  [R0603]
R83  20K  R0603  [R0603]
R84  20K  R0603  [R0603]
R85  20K  R0603  [R0603]
R86  20K  R0603  [R0603]
R87  20K  R0603  [R0603]

### Nets
+24V: C54.1 C55.1 C56.1 C65.1 C66.1 C67.1 C76.1 C77.1 C78.1 CON4.B1 EC1.+ EC2.+ EC3.+ IC6.10(CD+) IC7.10(CD+) IC8.10(CD+) R48.1 R49.1 R50.1 R51.1 R52.1 R53.1 R54.1 R55.1 R64.1 R65.1 R66.1 R67.1 R68.1 R69.1 R70.1 R71.1 R80.1 R81.1 R82.1 R83.1 R84.1 R85.1 R86.1 R87.1 ; also sheet 4
DOUT1: R40.2 ; also sheet 1
DOUT2: R41.2 ; also sheet 1
DOUT3: R42.2 ; also sheet 1
DOUT4: R43.2 ; also sheet 1
DOUT5: R44.2 ; also sheet 1
DOUT6: R45.2 ; also sheet 1
DOUT7: R46.2 ; also sheet 1
DOUT8: R47.2 ; also sheet 1
DOUT9: R56.2 ; also sheet 1
DOUT10: R57.2 ; also sheet 1
DOUT11: R58.2 ; also sheet 1
DOUT12: R59.2 ; also sheet 1
DOUT13: R60.2 ; also sheet 1
DOUT14: R61.2 ; also sheet 1
DOUT15: R62.2 ; also sheet 1
DOUT16: R63.2 ; also sheet 1
DOUT17: R72.2 ; also sheet 1
DOUT18: R73.2 ; also sheet 1
DOUT19: R74.2 ; also sheet 1
DOUT20: R75.2 ; also sheet 1
DOUT21: R76.2 ; also sheet 1
DOUT22: R77.2 ; also sheet 1
DOUT23: R78.2 ; also sheet 1
DOUT24: R79.2 ; also sheet 1
GND: OK1.2(A:C) OK1.4(B:C) OK1.6(C:C) OK1.8(D:C) OK2.2(A:C) OK2.4(B:C) OK2.6(C:C) OK2.8(D:C) OK3.2(A:C) OK3.4(B:C) OK3.6(C:C) OK3.8(D:C) OK4.2(A:C) OK4.4(B:C) OK4.6(C:C) OK4.8(D:C) OK5.2(A:C) OK5.4(B:C) OK5.6(C:C) OK5.8(D:C) OK6.2(A:C) OK6.4(B:C) OK6.6(C:C) OK6.8(D:C) ; also sheet 1,3,4
GND1: C46.2 C47.2 C48.2 C49.2 C50.2 C51.2 C52.2 C53.2 C54.2 C55.2 C56.2 C57.2 C58.2 C59.2 C60.2 C61.2 C62.2 C63.2 C64.2 C65.2 C66.2 C67.2 C68.2 C69.2 C70.2 C71.2 C72.2 C73.2 C74.2 C75.2 C76.2 C77.2 C78.2 CON4.A1 EC1.- EC2.- EC3.- IC6.9(GND) IC7.9(GND) IC8.9(GND) ; also sheet 1
N$25: C46.1 IC6.1(I1) OK1.15(A:EMIT)
N$26: C47.1 IC6.2(I2) OK1.13(B:EMIT)
N$27: C48.1 IC6.3(I3) OK1.11(C:EMIT)
N$28: C49.1 IC6.4(I4) OK1.9(D:EMIT)
N$29: C50.1 IC6.5(I5) OK2.15(A:EMIT)
N$30: C51.1 IC6.6(I6) OK2.13(B:EMIT)
N$31: C52.1 IC6.7(I7) OK2.11(C:EMIT)
N$32: C53.1 IC6.8(I8) OK2.9(D:EMIT)
N$33: C57.1 IC7.1(I1) OK3.15(A:EMIT)
N$34: C58.1 IC7.2(I2) OK3.13(B:EMIT)
N$35: C59.1 IC7.3(I3) OK3.11(C:EMIT)
N$36: C60.1 IC7.4(I4) OK3.9(D:EMIT)
N$37: C61.1 IC7.5(I5) OK4.15(A:EMIT)
N$38: C62.1 IC7.6(I6) OK4.13(B:EMIT)
N$39: C63.1 IC7.7(I7) OK4.11(C:EMIT)
N$40: C64.1 IC7.8(I8) OK4.9(D:EMIT)
N$41: C75.1 IC8.8(I8) OK6.9(D:EMIT)
N$42: C68.1 IC8.1(I1) OK5.15(A:EMIT)
N$43: C69.1 IC8.2(I2) OK5.13(B:EMIT)
N$44: C70.1 IC8.3(I3) OK5.11(C:EMIT)
N$45: C71.1 IC8.4(I4) OK5.9(D:EMIT)
N$46: C72.1 IC8.5(I5) OK6.15(A:EMIT)
N$47: C73.1 IC8.6(I6) OK6.13(B:EMIT)
N$48: C74.1 IC8.7(I7) OK6.11(C:EMIT)
N$65: OK1.16(A:COL) R48.2
N$66: OK1.14(B:COL) R49.2
N$67: OK1.12(C:COL) R50.2
N$68: OK1.10(D:COL) R51.2
N$69: OK2.16(A:COL) R52.2
N$70: OK2.14(B:COL) R53.2
N$71: OK2.12(C:COL) R54.2
N$72: OK2.10(D:COL) R55.2
N$73: OK3.16(A:COL) R64.2
N$74: OK3.14(B:COL) R65.2
N$75: OK3.12(C:COL) R66.2
N$76: OK3.10(D:COL) R67.2
N$77: OK4.16(A:COL) R68.2
N$78: OK4.14(B:COL) R69.2
N$79: OK4.12(C:COL) R70.2
N$80: OK4.10(D:COL) R71.2
N$82: OK1.1(A:A) R40.1
N$85: OK1.3(B:A) R41.1
N$86: OK1.5(C:A) R42.1
N$105: OK5.16(A:COL) R80.2
N$106: OK5.14(B:COL) R81.2
N$107: OK5.12(C:COL) R82.2
N$108: OK5.10(D:COL) R83.2
N$109: OK6.16(A:COL) R84.2
N$110: OK6.14(B:COL) R85.2
N$111: OK6.12(C:COL) R86.2
N$112: OK6.10(D:COL) R87.2
N$116: OK1.7(D:A) R43.1
N$117: OK2.1(A:A) R44.1
N$118: OK2.3(B:A) R45.1
N$119: OK2.5(C:A) R46.1
N$120: OK2.7(D:A) R47.1
N$122: OK3.1(A:A) R56.1
N$125: OK3.3(B:A) R57.1
N$126: OK3.5(C:A) R58.1
N$229: OK5.1(A:A) R72.1
N$232: OK5.3(B:A) R73.1
N$233: OK5.5(C:A) R74.1
N$239: OK5.7(D:A) R75.1
N$240: OK6.1(A:A) R76.1
N$241: OK6.3(B:A) R77.1
N$242: OK6.5(C:A) R78.1
N$243: OK6.7(D:A) R79.1
N$247: OK3.7(D:A) R59.1
N$248: OK4.1(A:A) R60.1
N$249: OK4.3(B:A) R61.1
N$250: OK4.5(C:A) R62.1
N$251: OK4.7(D:A) R63.1
RELAY_DRV_OUT_1: CON4.A2 IC6.18(O1)
RELAY_DRV_OUT_2: CON4.B2 IC6.17(O2)
RELAY_DRV_OUT_3: CON4.A3 IC6.16(O3)
RELAY_DRV_OUT_4: CON4.B3 IC6.15(O4)
RELAY_DRV_OUT_5: CON4.A4 IC6.14(O5)
RELAY_DRV_OUT_6: CON4.B4 IC6.13(O6)
RELAY_DRV_OUT_7: CON4.A5 IC6.12(O7)
RELAY_DRV_OUT_8: CON4.B5 IC6.11(O8)
RELAY_DRV_OUT_9: CON4.A6 IC7.18(O1)
RELAY_DRV_OUT_10: CON4.B6 IC7.17(O2)
RELAY_DRV_OUT_11: CON4.A7 IC7.16(O3)
RELAY_DRV_OUT_12: CON4.B7 IC7.15(O4)
RELAY_DRV_OUT_13: CON4.A8 IC7.14(O5)
RELAY_DRV_OUT_14: CON4.B8 IC7.13(O6)
RELAY_DRV_OUT_15: CON4.A9 IC7.12(O7)
RELAY_DRV_OUT_16: CON4.B9 IC7.11(O8)
RELAY_DRV_OUT_17: CON4.A10 IC8.18(O1)
RELAY_DRV_OUT_18: CON4.B10 IC8.17(O2)
RELAY_DRV_OUT_19: CON4.A11 IC8.16(O3)
RELAY_DRV_OUT_20: CON4.B11 IC8.15(O4)
RELAY_DRV_OUT_21: CON4.A12 IC8.14(O5)
RELAY_DRV_OUT_22: CON4.B12 IC8.13(O6)
RELAY_DRV_OUT_23: CON4.A13 IC8.12(O7)
RELAY_DRV_OUT_24: CON4.B13 IC8.11(O8)

### Buses
DOUT[1..24]
RELAY_DRV_OUT_[1..24]

### Notes on the sheet
- 继电器隔离驱动

## Sheet 3 of 5: 24 路开关量输入
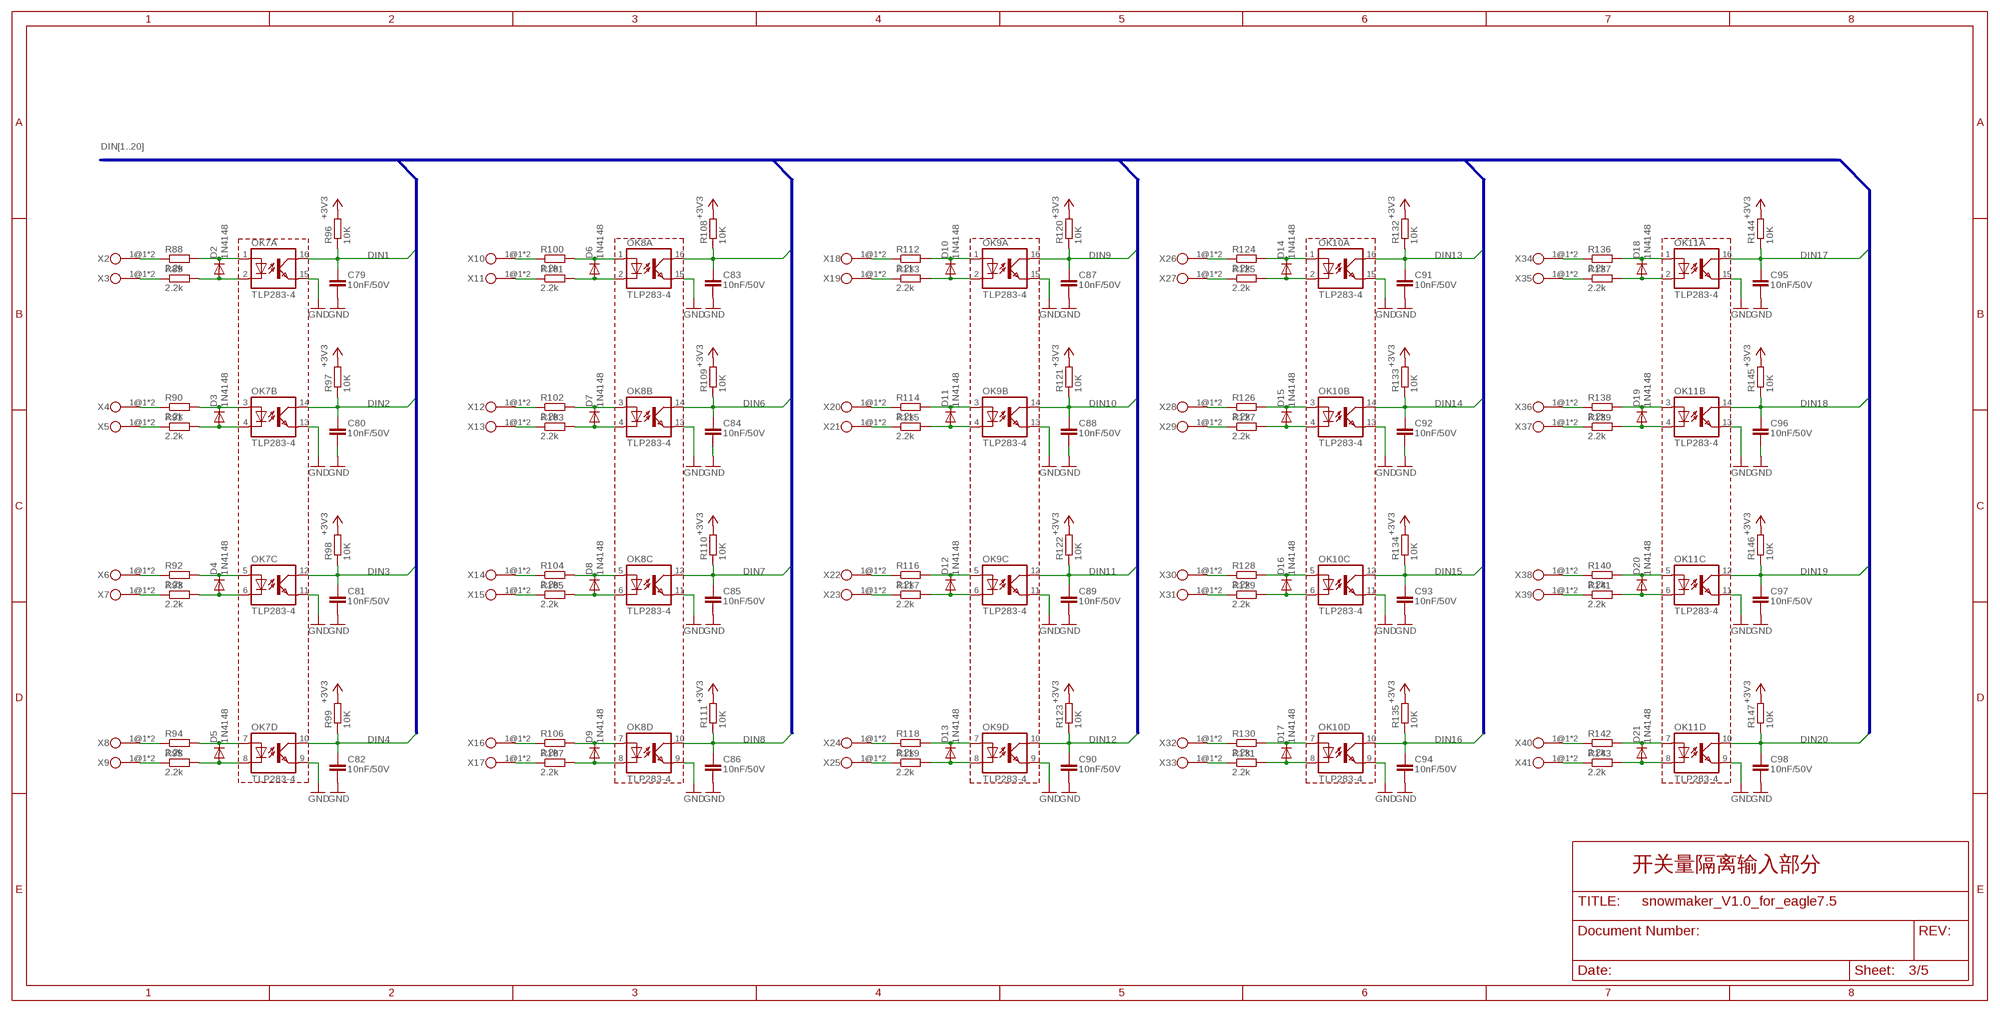
[diagram p7: schematic, sheet 3]

### Parts
C79  10nF/50V  C0603  [C0603]
C80  10nF/50V  C0603  [C0603]
C81  10nF/50V  C0603  [C0603]
C82  10nF/50V  C0603  [C0603]
C83  10nF/50V  C0603  [C0603]
C84  10nF/50V  C0603  [C0603]
C85  10nF/50V  C0603  [C0603]
C86  10nF/50V  C0603  [C0603]
C87  10nF/50V  C0603  [C0603]
C88  10nF/50V  C0603  [C0603]
C89  10nF/50V  C0603  [C0603]
C90  10nF/50V  C0603  [C0603]
C91  10nF/50V  C0603  [C0603]
C92  10nF/50V  C0603  [C0603]
C93  10nF/50V  C0603  [C0603]
C94  10nF/50V  C0603  [C0603]
C95  10nF/50V  C0603  [C0603]
C96  10nF/50V  C0603  [C0603]
C97  10nF/50V  C0603  [C0603]
C98  10nF/50V  C0603  [C0603]
D2  1N4148  [MINI_MELF(LL-34)]
D3  1N4148  [MINI_MELF(LL-34)]
D4  1N4148  [MINI_MELF(LL-34)]
D5  1N4148  [MINI_MELF(LL-34)]
D6  1N4148  [MINI_MELF(LL-34)]
D7  1N4148  [MINI_MELF(LL-34)]
D8  1N4148  [MINI_MELF(LL-34)]
D9  1N4148  [MINI_MELF(LL-34)]
D10  1N4148  [MINI_MELF(LL-34)]
D11  1N4148  [MINI_MELF(LL-34)]
D12  1N4148  [MINI_MELF(LL-34)]
D13  1N4148  [MINI_MELF(LL-34)]
D14  1N4148  [MINI_MELF(LL-34)]
D15  1N4148  [MINI_MELF(LL-34)]
D16  1N4148  [MINI_MELF(LL-34)]
D17  1N4148  [MINI_MELF(LL-34)]
D18  1N4148  [MINI_MELF(LL-34)]
D19  1N4148  [MINI_MELF(LL-34)]
D20  1N4148  [MINI_MELF(LL-34)]
D21  1N4148  [MINI_MELF(LL-34)]
OK7  TLP283-4  [MINI-FLAT-16]
OK8  TLP283-4  [MINI-FLAT-16]
OK9  TLP283-4  [MINI-FLAT-16]
OK10  TLP283-4  [MINI-FLAT-16]
OK11  TLP283-4  [MINI-FLAT-16]
R88  2.2k  R1206  [R1206]
R89  2.2k  R1206  [R1206]
R90  2.2k  R1206  [R1206]
R91  2.2k  R1206  [R1206]
R92  2.2k  R1206  [R1206]
R93  2.2k  R1206  [R1206]
R94  2.2k  R1206  [R1206]
R95  2.2k  R1206  [R1206]
R96  10K  R0603  [R0603]
R97  10K  R0603  [R0603]
R98  10K  R0603  [R0603]
R99  10K  R0603  [R0603]
R100  2.2k  R1206  [R1206]
R101  2.2k  R1206  [R1206]
R102  2.2k  R1206  [R1206]
R103  2.2k  R1206  [R1206]
R104  2.2k  R1206  [R1206]
R105  2.2k  R1206  [R1206]
R106  2.2k  R1206  [R1206]
R107  2.2k  R1206  [R1206]
R108  10K  R0603  [R0603]
R109  10K  R0603  [R0603]
R110  10K  R0603  [R0603]
R111  10K  R0603  [R0603]
R112  2.2k  R1206  [R1206]
R113  2.2k  R1206  [R1206]
R114  2.2k  R1206  [R1206]
R115  2.2k  R1206  [R1206]
R116  2.2k  R1206  [R1206]
R117  2.2k  R1206  [R1206]
R118  2.2k  R1206  [R1206]
R119  2.2k  R1206  [R1206]
R120  10K  R0603  [R0603]
R121  10K  R0603  [R0603]
R122  10K  R0603  [R0603]
R123  10K  R0603  [R0603]
R124  2.2k  R1206  [R1206]
R125  2.2k  R1206  [R1206]
R126  2.2k  R1206  [R1206]
R127  2.2k  R1206  [R1206]
R128  2.2k  R1206  [R1206]
R129  2.2k  R1206  [R1206]
R130  2.2k  R1206  [R1206]
R131  2.2k  R1206  [R1206]
R132  10K  R0603  [R0603]
R133  10K  R0603  [R0603]
R134  10K  R0603  [R0603]
R135  10K  R0603  [R0603]
R136  2.2k  R1206  [R1206]
R137  2.2k  R1206  [R1206]
R138  2.2k  R1206  [R1206]
R139  2.2k  R1206  [R1206]
R140  2.2k  R1206  [R1206]
R141  2.2k  R1206  [R1206]
R142  2.2k  R1206  [R1206]
R143  2.2k  R1206  [R1206]
R144  10K  R0603  [R0603]
R145  10K  R0603  [R0603]
R146  10K  R0603  [R0603]
R147  10K  R0603  [R0603]
X2  FFKDS/V1-5.08_FIRST  [FFKDS/V1-5,08-1_FIRST]
X3  FFKDS/V1-5.08_MIDDLE  [FFKDS/V1-5,08-1_MIDDLE]
X4  FFKDS/V1-5.08_MIDDLE  [FFKDS/V1-5,08-1_MIDDLE]
X5  FFKDS/V1-5.08_MIDDLE  [FFKDS/V1-5,08-1_MIDDLE]
X6  FFKDS/V1-5.08_MIDDLE  [FFKDS/V1-5,08-1_MIDDLE]
X7  FFKDS/V1-5.08_MIDDLE  [FFKDS/V1-5,08-1_MIDDLE]
X8  FFKDS/V1-5.08_MIDDLE  [FFKDS/V1-5,08-1_MIDDLE]
X9  FFKDS/V1-5.08_MIDDLE  [FFKDS/V1-5,08-1_MIDDLE]
X10  FFKDS/V1-5.08_MIDDLE  [FFKDS/V1-5,08-1_MIDDLE]
X11  FFKDS/V1-5.08_MIDDLE  [FFKDS/V1-5,08-1_MIDDLE]
X12  FFKDS/V1-5.08_MIDDLE  [FFKDS/V1-5,08-1_MIDDLE]
X13  FFKDS/V1-5.08_MIDDLE  [FFKDS/V1-5,08-1_MIDDLE]
X14  FFKDS/V1-5.08_MIDDLE  [FFKDS/V1-5,08-1_MIDDLE]
X15  FFKDS/V1-5.08_MIDDLE  [FFKDS/V1-5,08-1_MIDDLE]
X16  FFKDS/V1-5.08_MIDDLE  [FFKDS/V1-5,08-1_MIDDLE]
X17  FFKDS/V1-5.08_MIDDLE  [FFKDS/V1-5,08-1_MIDDLE]
X18  FFKDS/V1-5.08_MIDDLE  [FFKDS/V1-5,08-1_MIDDLE]
X19  FFKDS/V1-5.08_MIDDLE  [FFKDS/V1-5,08-1_MIDDLE]
X20  FFKDS/V1-5.08_MIDDLE  [FFKDS/V1-5,08-1_MIDDLE]
X21  FFKDS/V1-5.08_MIDDLE  [FFKDS/V1-5,08-1_MIDDLE]
X22  FFKDS/V1-5.08_MIDDLE  [FFKDS/V1-5,08-1_MIDDLE]
X23  FFKDS/V1-5.08_MIDDLE  [FFKDS/V1-5,08-1_MIDDLE]
X24  FFKDS/V1-5.08_MIDDLE  [FFKDS/V1-5,08-1_MIDDLE]
X25  FFKDS/V1-5.08_MIDDLE  [FFKDS/V1-5,08-1_MIDDLE]
X26  FFKDS/V1-5.08_MIDDLE  [FFKDS/V1-5,08-1_MIDDLE]
X27  FFKDS/V1-5.08_MIDDLE  [FFKDS/V1-5,08-1_MIDDLE]
X28  FFKDS/V1-5.08_MIDDLE  [FFKDS/V1-5,08-1_MIDDLE]
X29  FFKDS/V1-5.08_MIDDLE  [FFKDS/V1-5,08-1_MIDDLE]
X30  FFKDS/V1-5.08_MIDDLE  [FFKDS/V1-5,08-1_MIDDLE]
X31  FFKDS/V1-5.08_MIDDLE  [FFKDS/V1-5,08-1_MIDDLE]
X32  FFKDS/V1-5.08_MIDDLE  [FFKDS/V1-5,08-1_MIDDLE]
X33  FFKDS/V1-5.08_MIDDLE  [FFKDS/V1-5,08-1_MIDDLE]
X34  FFKDS/V1-5.08_MIDDLE  [FFKDS/V1-5,08-1_MIDDLE]
X35  FFKDS/V1-5.08_MIDDLE  [FFKDS/V1-5,08-1_MIDDLE]
X36  FFKDS/V1-5.08_MIDDLE  [FFKDS/V1-5,08-1_MIDDLE]
X37  FFKDS/V1-5.08_MIDDLE  [FFKDS/V1-5,08-1_MIDDLE]
X38  FFKDS/V1-5.08_MIDDLE  [FFKDS/V1-5,08-1_MIDDLE]
X39  FFKDS/V1-5.08_MIDDLE  [FFKDS/V1-5,08-1_MIDDLE]
X40  FFKDS/V1-5.08_MIDDLE  [FFKDS/V1-5,08-1_MIDDLE]
X41  FFKDS/V1-5.08_LAST  [FFKDS/V1-5,08-1_LAST]

### Nets
+3V3: R96.2 R97.2 R98.2 R99.2 R108.2 R109.2 R110.2 R111.2 R120.2 R121.2 R122.2 R123.2 R132.2 R133.2 R134.2 R135.2 R144.2 R145.2 R146.2 R147.2 ; also sheet 1
DIN1: C79.1 OK7.16(A:COL) R96.1 ; also sheet 1
DIN2: C80.1 OK7.14(B:COL) R97.1 ; also sheet 1
DIN3: C81.1 OK7.12(C:COL) R98.1 ; also sheet 1
DIN4: C82.1 OK7.10(D:COL) R99.1 ; also sheet 1
DIN5: C83.1 OK8.16(A:COL) R108.1 ; also sheet 1
DIN6: C84.1 OK8.14(B:COL) R109.1 ; also sheet 1
DIN7: C85.1 OK8.12(C:COL) R110.1 ; also sheet 1
DIN8: C86.1 OK8.10(D:COL) R111.1 ; also sheet 1
DIN9: C87.1 OK9.16(A:COL) R120.1 ; also sheet 1
DIN10: C88.1 OK9.14(B:COL) R121.1 ; also sheet 1
DIN11: C89.1 OK9.12(C:COL) R122.1 ; also sheet 1
DIN12: C90.1 OK9.10(D:COL) R123.1 ; also sheet 1
DIN13: C91.1 OK10.16(A:COL) R132.1 ; also sheet 1
DIN14: C92.1 OK10.14(B:COL) R133.1 ; also sheet 1
DIN15: C93.1 OK10.12(C:COL) R134.1 ; also sheet 1
DIN16: C94.1 OK10.10(D:COL) R135.1 ; also sheet 1
DIN17: C95.1 OK11.16(A:COL) R144.1 ; also sheet 1
DIN18: C96.1 OK11.14(B:COL) R145.1 ; also sheet 1
DIN19: C97.1 OK11.12(C:COL) R146.1 ; also sheet 1
DIN20: C98.1 OK11.10(D:COL) R147.1 ; also sheet 1
GND: C79.2 C80.2 C81.2 C82.2 C83.2 C84.2 C85.2 C86.2 C87.2 C88.2 C89.2 C90.2 C91.2 C92.2 C93.2 C94.2 C95.2 C96.2 C97.2 C98.2 OK7.9(D:EMIT) OK7.11(C:EMIT) OK7.13(B:EMIT) OK7.15(A:EMIT) OK8.9(D:EMIT) OK8.11(C:EMIT) OK8.13(B:EMIT) OK8.15(A:EMIT) OK9.9(D:EMIT) OK9.11(C:EMIT) OK9.13(B:EMIT) OK9.15(A:EMIT) OK10.9(D:EMIT) OK10.11(C:EMIT) OK10.13(B:EMIT) OK10.15(A:EMIT) OK11.9(D:EMIT) OK11.11(C:EMIT) OK11.13(B:EMIT) OK11.15(A:EMIT) ; also sheet 1,2,4
N$1: D2.C OK7.1(A:A) R88.2
N$2: D2.A OK7.2(A:C) R89.2
N$3: D3.C OK7.3(B:A) R90.2
N$4: D3.A OK7.4(B:C) R91.2
N$5: D4.C OK7.5(C:A) R92.2
N$6: D4.A OK7.6(C:C) R93.2
N$7: D5.C OK7.7(D:A) R94.2
N$8: D5.A OK7.8(D:C) R95.2
N$9: D6.C OK8.1(A:A) R100.2
N$10: D6.A OK8.2(A:C) R101.2
N$11: D7.C OK8.3(B:A) R102.2
N$12: D7.A OK8.4(B:C) R103.2
N$13: D8.C OK8.5(C:A) R104.2
N$14: D8.A OK8.6(C:C) R105.2
N$15: D9.C OK8.7(D:A) R106.2
N$16: D9.A OK8.8(D:C) R107.2
N$17: D10.C OK9.1(A:A) R112.2
N$18: D10.A OK9.2(A:C) R113.2
N$19: D11.C OK9.3(B:A) R114.2
N$20: D11.A OK9.4(B:C) R115.2
N$21: D12.C OK9.5(C:A) R116.2
N$22: D12.A OK9.6(C:C) R117.2
N$23: D13.C OK9.7(D:A) R118.2
N$24: D13.A OK9.8(D:C) R119.2
N$145: R88.1 X2.1@1 X2.2@1
N$146: R89.1 X3.1@1 X3.2@1
N$147: R112.1 X18.1@1 X18.2@1
N$148: R113.1 X19.1@1 X19.2@1
N$149: R114.1 X20.1@1 X20.2@1
N$150: R115.1 X21.1@1 X21.2@1
N$151: R116.1 X22.1@1 X22.2@1
N$152: R117.1 X23.1@1 X23.2@1
N$153: R118.1 X24.1@1 X24.2@1
N$154: R119.1 X25.1@1 X25.2@1
N$155: R100.1 X10.1@1 X10.2@1
N$156: R101.1 X11.1@1 X11.2@1
N$157: R102.1 X12.1@1 X12.2@1
N$158: R103.1 X13.1@1 X13.2@1
N$159: R104.1 X14.1@1 X14.2@1
N$160: R105.1 X15.1@1 X15.2@1
N$161: R106.1 X16.1@1 X16.2@1
N$162: R107.1 X17.1@1 X17.2@1
N$163: R90.1 X4.1@1 X4.2@1
N$164: R91.1 X5.1@1 X5.2@1
N$165: R92.1 X6.1@1 X6.2@1
N$166: R93.1 X7.1@1 X7.2@1
N$167: R94.1 X8.1@1 X8.2@1
N$168: R95.1 X9.1@1 X9.2@1
N$181: D14.C OK10.1(A:A) R124.2
N$182: D14.A OK10.2(A:C) R125.2
N$183: D15.C OK10.3(B:A) R126.2
N$184: D15.A OK10.4(B:C) R127.2
N$185: D16.C OK10.5(C:A) R128.2
N$186: D16.A OK10.6(C:C) R129.2
N$187: D17.C OK10.7(D:A) R130.2
N$188: D17.A OK10.8(D:C) R131.2
N$189: R124.1 X26.1@1 X26.2@1
N$190: R125.1 X27.1@1 X27.2@1
N$191: R126.1 X28.1@1 X28.2@1
N$192: R127.1 X29.1@1 X29.2@1
N$193: R128.1 X30.1@1 X30.2@1
N$194: R129.1 X31.1@1 X31.2@1
N$195: R130.1 X32.1@1 X32.2@1
N$196: R131.1 X33.1@1 X33.2@1
N$201: D18.C OK11.1(A:A) R136.2
N$202: D18.A OK11.2(A:C) R137.2
N$203: D19.C OK11.3(B:A) R138.2
N$204: D19.A OK11.4(B:C) R139.2
N$205: D20.C OK11.5(C:A) R140.2
N$206: D20.A OK11.6(C:C) R141.2
N$207: D21.C OK11.7(D:A) R142.2
N$208: D21.A OK11.8(D:C) R143.2
N$209: R136.1 X34.1@1 X34.2@1
N$210: R137.1 X35.1@1 X35.2@1
N$211: R138.1 X36.1@1 X36.2@1
N$212: R139.1 X37.1@1 X37.2@1
N$213: R140.1 X38.1@1 X38.2@1
N$214: R141.1 X39.1@1 X39.2@1
N$215: R142.1 X40.1@1 X40.2@1
N$216: R143.1 X41.1@1 X41.2@1

### Buses
DIN[1..20]

### Notes on the sheet
- 开关量隔离输入部分

## Sheet 4 of 5: 12 CHANNEL ANALOG INPUT | 4-20mA/0-2.5V
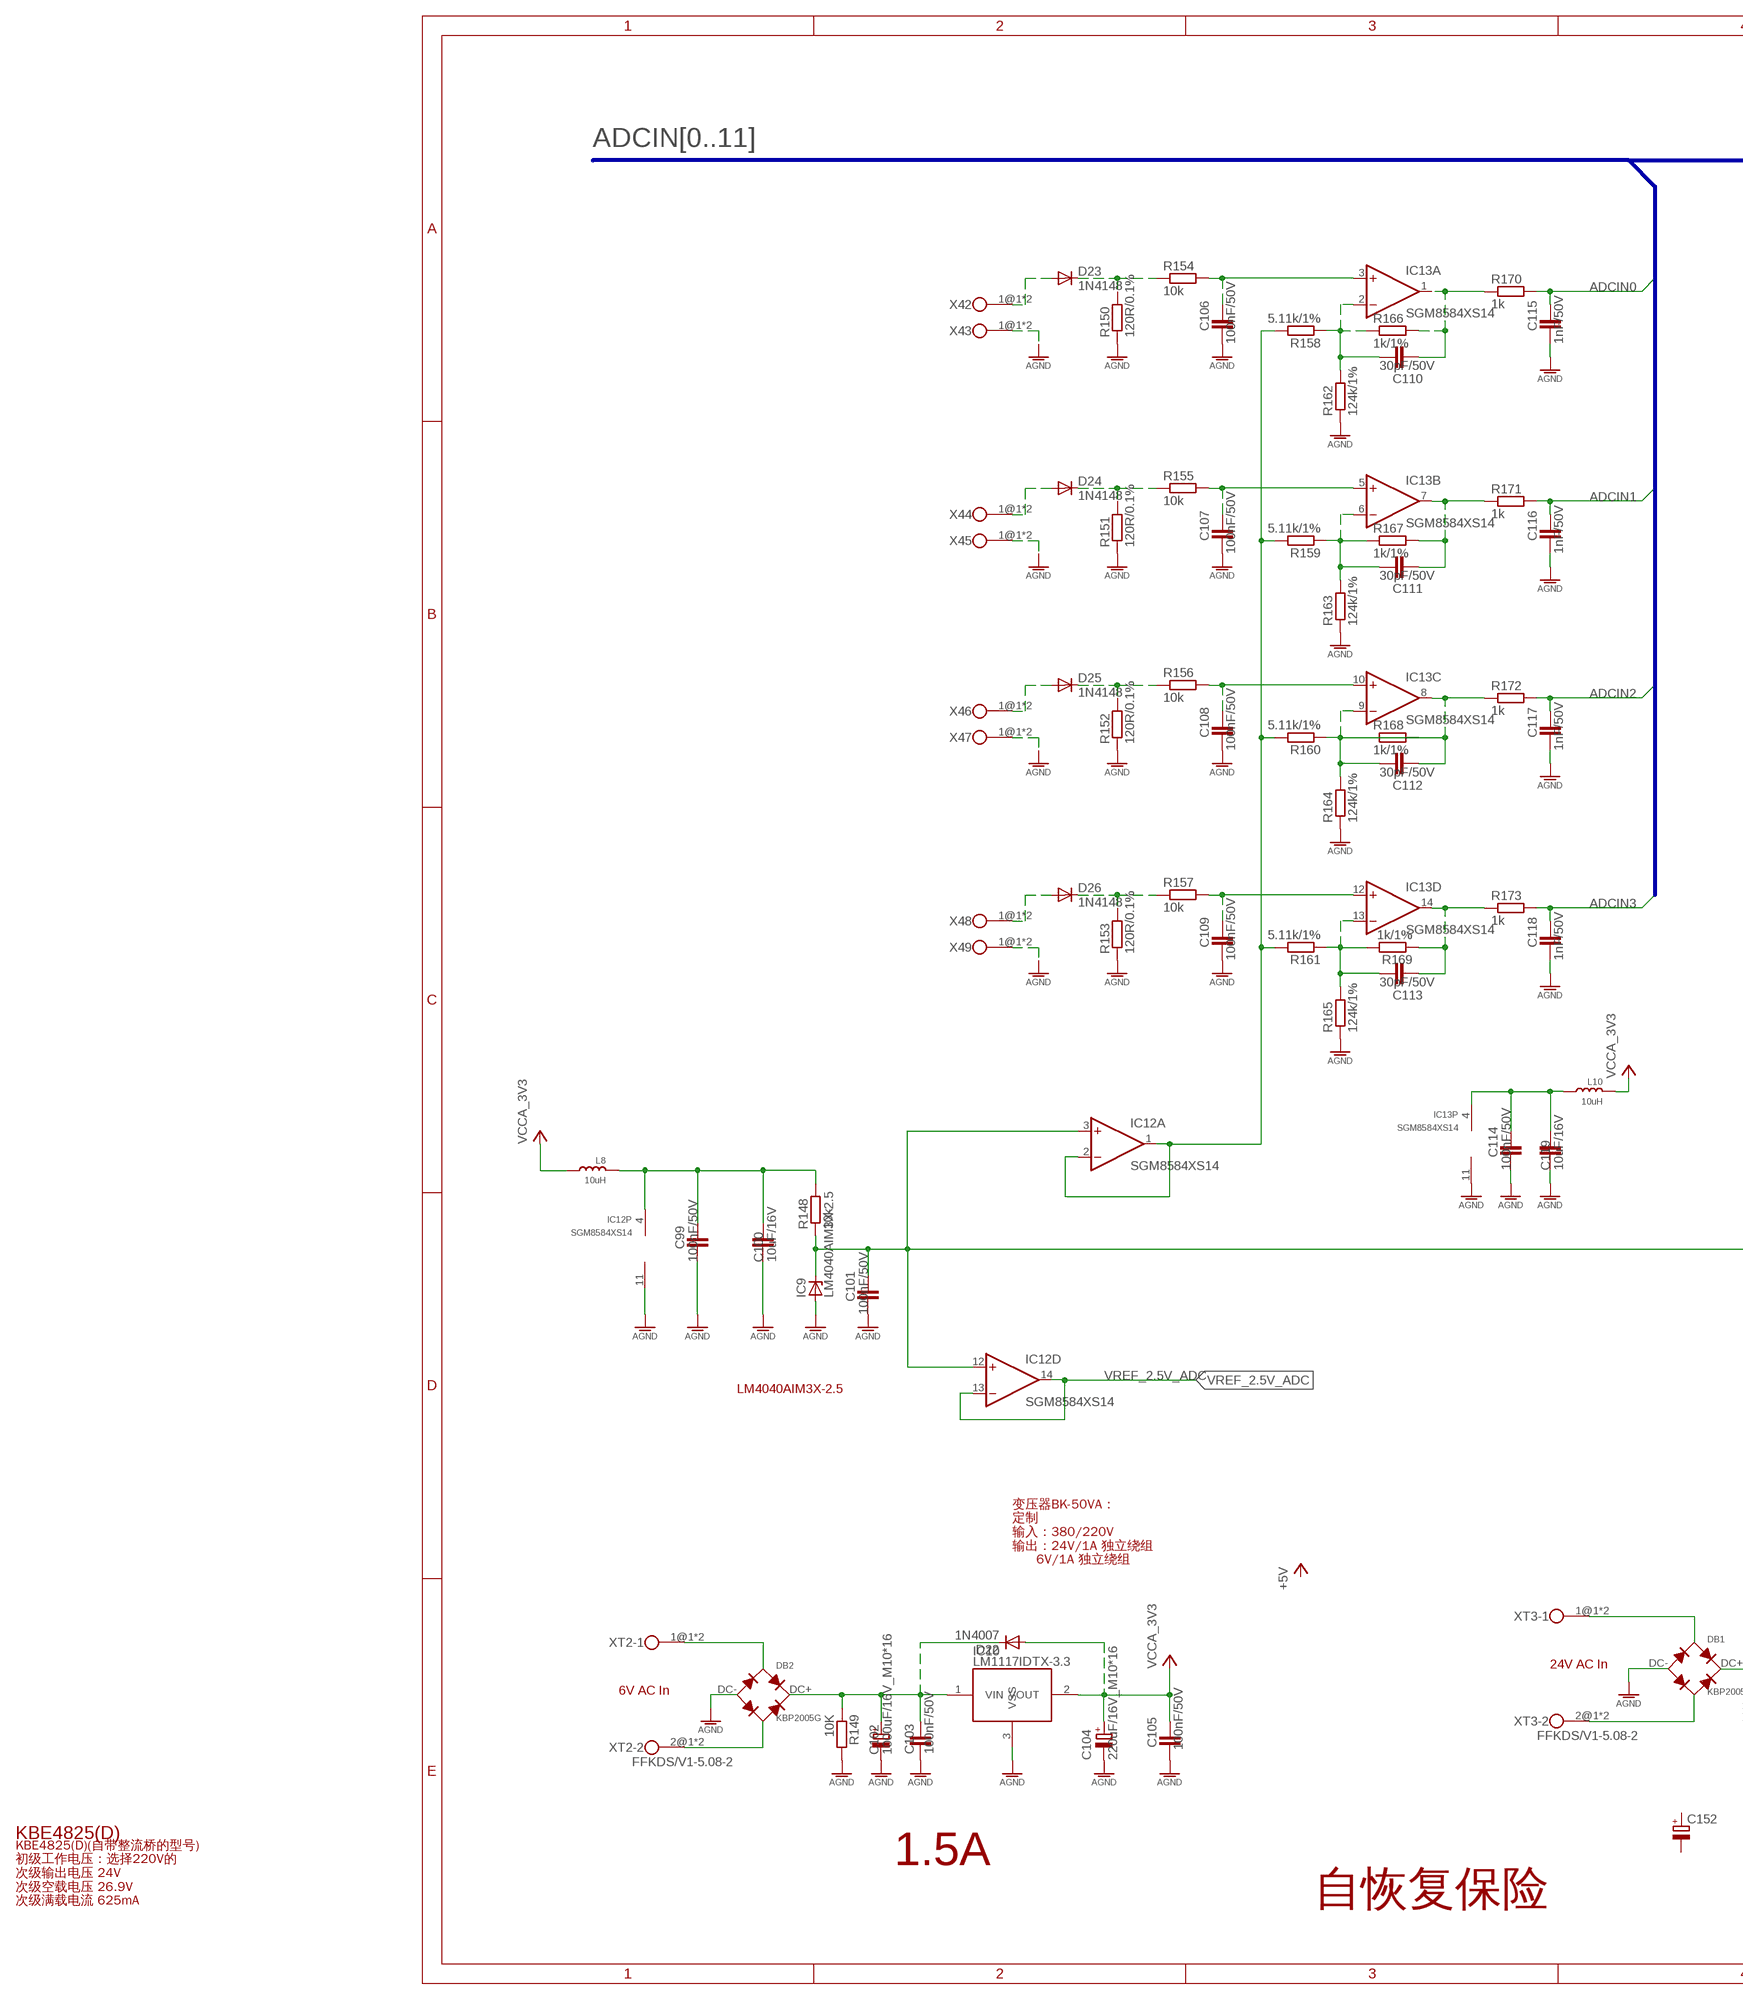
[diagram p8: schematic, sheet 4, part 1 of 2]
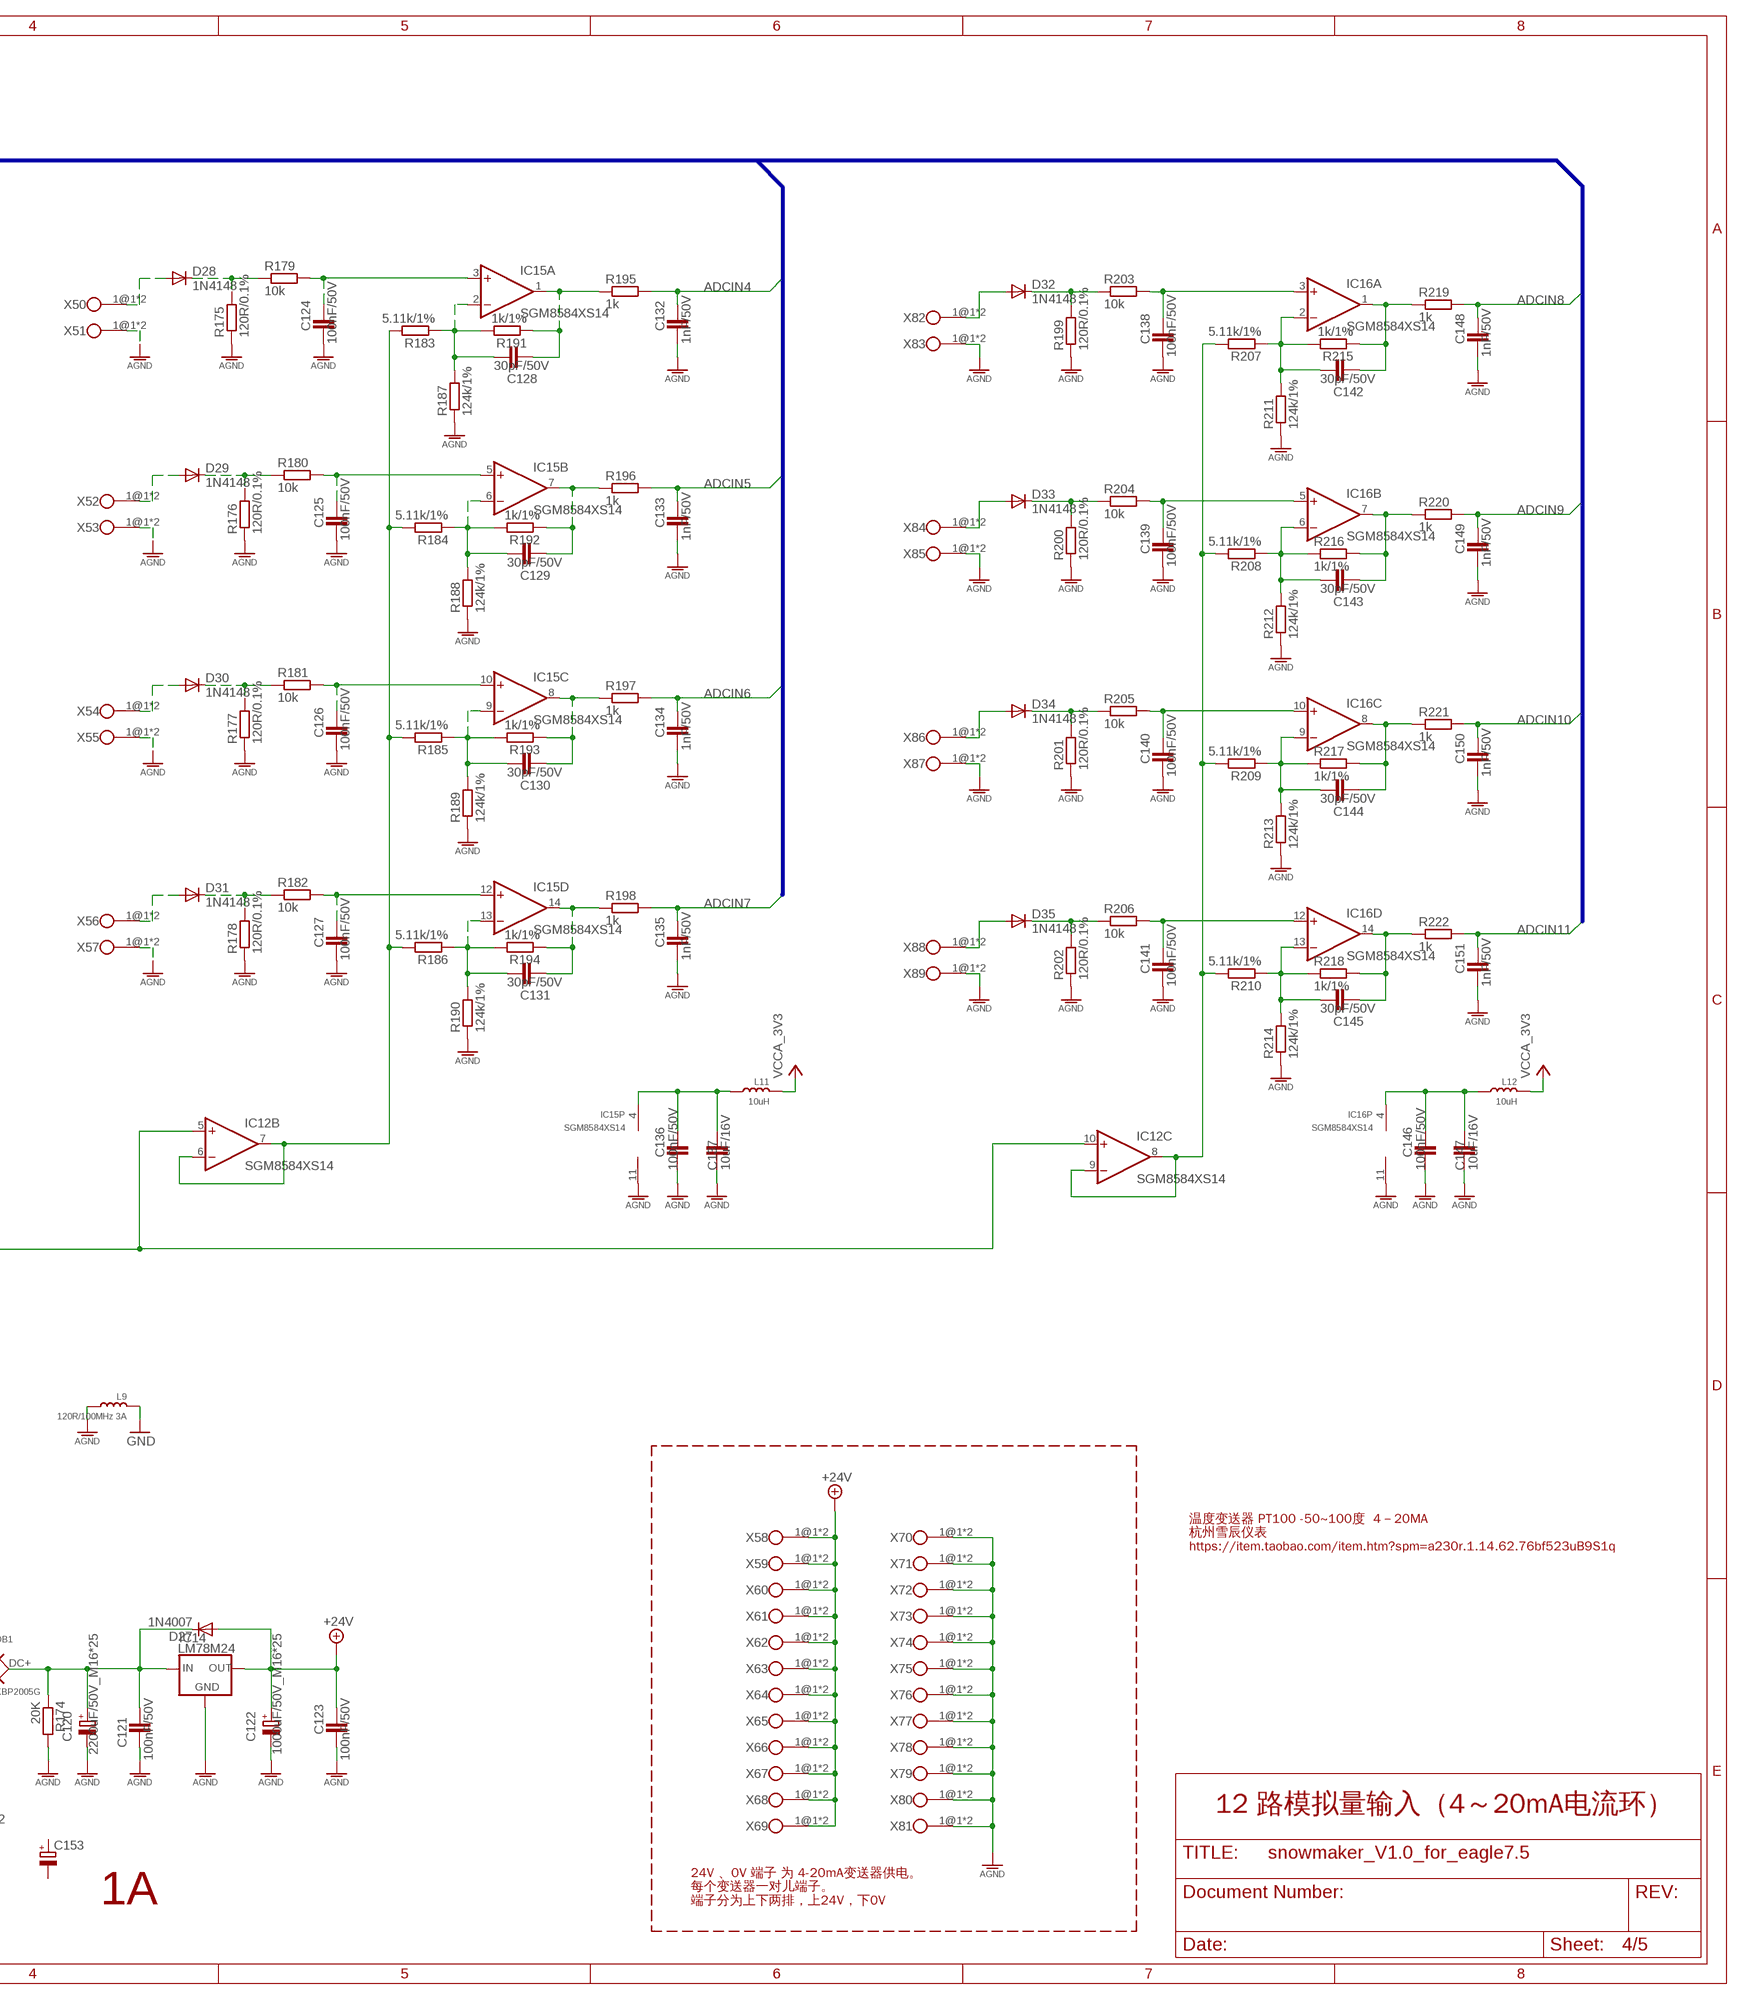
[diagram p9: schematic, sheet 4, part 2 of 2]

### Parts
C99  100nF/50V  C0603  [C0603]
C100  10uF/16V  C0603  [C0603]
C101  100nF/50V  C0603  [C0603]
C102  1000uF/16V_M10*16  CPOL-EUE3.5-10  [E3,5-10]
C103  100nF/50V  C0603  [C0603]
C104  220uF/16V_M10*16  CPOL-EUE3.5-10  [E3,5-10]
C105  100nF/50V  C0603  [C0603]
C106  100nF/50V  C0603  [C0603]
C107  100nF/50V  C0603  [C0603]
C108  100nF/50V  C0603  [C0603]
C109  100nF/50V  C0603  [C0603]
C110  30pF/50V  C0603  [C0603]
C111  30pF/50V  C0603  [C0603]
C112  30pF/50V  C0603  [C0603]
C113  30pF/50V  C0603  [C0603]
C114  100nF/50V  C0603  [C0603]
C115  1nF/50V  C0603  [C0603]
C116  1nF/50V  C0603  [C0603]
C117  1nF/50V  C0603  [C0603]
C118  1nF/50V  C0603  [C0603]
C119  10uF/16V  C0603  [C0603]
C120  2200uF/50V_M16*25  CPOL-EUE7.5-16  [E7,5-16]
C121  100nF/50V  C0603  [C0603]
C122  1000uF/50V_M16*25  CPOL-EUE7.5-16  [E7,5-16]
C123  100nF/50V  C0603  [C0603]
C124  100nF/50V  C0603  [C0603]
C125  100nF/50V  C0603  [C0603]
C126  100nF/50V  C0603  [C0603]
C127  100nF/50V  C0603  [C0603]
C128  30pF/50V  C0603  [C0603]
C129  30pF/50V  C0603  [C0603]
C130  30pF/50V  C0603  [C0603]
C131  30pF/50V  C0603  [C0603]
C132  1nF/50V  C0603  [C0603]
C133  1nF/50V  C0603  [C0603]
C134  1nF/50V  C0603  [C0603]
C135  1nF/50V  C0603  [C0603]
C136  100nF/50V  C0603  [C0603]
C137  10uF/16V  C0603  [C0603]
C138  100nF/50V  C0603  [C0603]
C139  100nF/50V  C0603  [C0603]
C140  100nF/50V  C0603  [C0603]
C141  100nF/50V  C0603  [C0603]
C142  30pF/50V  C0603  [C0603]
C143  30pF/50V  C0603  [C0603]
C144  30pF/50V  C0603  [C0603]
C145  30pF/50V  C0603  [C0603]
C146  100nF/50V  C0603  [C0603]
C147  10uF/16V  C0603  [C0603]
C148  1nF/50V  C0603  [C0603]
C149  1nF/50V  C0603  [C0603]
C150  1nF/50V  C0603  [C0603]
C151  1nF/50V  C0603  [C0603]
C152  CPOL-EUTT5D11  [TT5D11]
C153  CPOL-EUTT5D11  [TT5D11]
D22  1N4007  1N4007-M7  [SMA-DO214AC]
D23  1N4148  [MINI_MELF(LL-34)]
D24  1N4148  [MINI_MELF(LL-34)]
D25  1N4148  [MINI_MELF(LL-34)]
D26  1N4148  [MINI_MELF(LL-34)]
D27  1N4007  1N4007-M7  [SMA-DO214AC]
D28  1N4148  [MINI_MELF(LL-34)]
D29  1N4148  [MINI_MELF(LL-34)]
D30  1N4148  [MINI_MELF(LL-34)]
D31  1N4148  [MINI_MELF(LL-34)]
D32  1N4148  [MINI_MELF(LL-34)]
D33  1N4148  [MINI_MELF(LL-34)]
D34  1N4148  [MINI_MELF(LL-34)]
D35  1N4148  [MINI_MELF(LL-34)]
DB1  KBP2005G  KBP  [KBP2005]
DB2  KBP2005G  KBP  [KBP2005]
IC9  LM4040AIM3X-2.5  [SOT23-3]
IC10  LM1117IDTX-3.3  [TO252]
IC12  SGM8584XS14  [SOIC-14]
IC13  SGM8584XS14  [SOIC-14]
IC14  LM78M24  78XXS  [78XXS]
IC15  SGM8584XS14  [SOIC-14]
IC16  SGM8584XS14  [SOIC-14]
L8  10uH  INDUCTOR/FERRITE-BEAD'0603'  [L0603]
L9  120R/100MHz 3A  INDUCTOR/FERRITE-BEAD'0805'  [L0805]
L10  10uH  INDUCTOR/FERRITE-BEAD'0603'  [L0603]
L11  10uH  INDUCTOR/FERRITE-BEAD'0603'  [L0603]
L12  10uH  INDUCTOR/FERRITE-BEAD'0603'  [L0603]
R148  10k  R0603  [R0603]
R149  10K  R0603  [R0603]
R150  120R/0.1%  R1206  [R1206]
R151  120R/0.1%  R1206  [R1206]
R152  120R/0.1%  R1206  [R1206]
R153  120R/0.1%  R1206  [R1206]
R154  10k  R0603  [R0603]
R155  10k  R0603  [R0603]
R156  10k  R0603  [R0603]
R157  10k  R0603  [R0603]
R158  5.11k/1%  R0603  [R0603]
R159  5.11k/1%  R0603  [R0603]
R160  5.11k/1%  R0603  [R0603]
R161  5.11k/1%  R0603  [R0603]
R162  124k/1%  R0603  [R0603]
R163  124k/1%  R0603  [R0603]
R164  124k/1%  R0603  [R0603]
R165  124k/1%  R0603  [R0603]
R166  1k/1%  R0603  [R0603]
R167  1k/1%  R0603  [R0603]
R168  1k/1%  R0603  [R0603]
R169  1k/1%  R0603  [R0603]
R170  1k  R0603  [R0603]
R171  1k  R0603  [R0603]
R172  1k  R0603  [R0603]
R173  1k  R0603  [R0603]
R174  20K  R0603  [R0603]
R175  120R/0.1%  R1206  [R1206]
R176  120R/0.1%  R1206  [R1206]
R177  120R/0.1%  R1206  [R1206]
R178  120R/0.1%  R1206  [R1206]
R179  10k  R0603  [R0603]
R180  10k  R0603  [R0603]
R181  10k  R0603  [R0603]
R182  10k  R0603  [R0603]
R183  5.11k/1%  R0603  [R0603]
R184  5.11k/1%  R0603  [R0603]
R185  5.11k/1%  R0603  [R0603]
R186  5.11k/1%  R0603  [R0603]
R187  124k/1%  R0603  [R0603]
R188  124k/1%  R0603  [R0603]
R189  124k/1%  R0603  [R0603]
R190  124k/1%  R0603  [R0603]
R191  1k/1%  R0603  [R0603]
R192  1k/1%  R0603  [R0603]
R193  1k/1%  R0603  [R0603]
R194  1k/1%  R0603  [R0603]
R195  1k  R0603  [R0603]
R196  1k  R0603  [R0603]
R197  1k  R0603  [R0603]
R198  1k  R0603  [R0603]
R199  120R/0.1%  R1206  [R1206]
R200  120R/0.1%  R1206  [R1206]
R201  120R/0.1%  R1206  [R1206]
R202  120R/0.1%  R1206  [R1206]
R203  10k  R0603  [R0603]
R204  10k  R0603  [R0603]
R205  10k  R0603  [R0603]
R206  10k  R0603  [R0603]
R207  5.11k/1%  R0603  [R0603]
R208  5.11k/1%  R0603  [R0603]
R209  5.11k/1%  R0603  [R0603]
R210  5.11k/1%  R0603  [R0603]
R211  124k/1%  R0603  [R0603]
R212  124k/1%  R0603  [R0603]
R213  124k/1%  R0603  [R0603]
R214  124k/1%  R0603  [R0603]
R215  1k/1%  R0603  [R0603]
R216  1k/1%  R0603  [R0603]
R217  1k/1%  R0603  [R0603]
R218  1k/1%  R0603  [R0603]
R219  1k  R0603  [R0603]
R220  1k  R0603  [R0603]
R221  1k  R0603  [R0603]
R222  1k  R0603  [R0603]
X42  FFKDS/V1-5.08_MIDDLE  [FFKDS/V1-5,08-1_MIDDLE]
X43  FFKDS/V1-5.08_LAST  [FFKDS/V1-5,08-1_LAST]
X44  FFKDS/V1-5.08_MIDDLE  [FFKDS/V1-5,08-1_MIDDLE]
X45  FFKDS/V1-5.08_MIDDLE  [FFKDS/V1-5,08-1_MIDDLE]
X46  FFKDS/V1-5.08_MIDDLE  [FFKDS/V1-5,08-1_MIDDLE]
X47  FFKDS/V1-5.08_MIDDLE  [FFKDS/V1-5,08-1_MIDDLE]
X48  FFKDS/V1-5.08_MIDDLE  [FFKDS/V1-5,08-1_MIDDLE]
X49  FFKDS/V1-5.08_MIDDLE  [FFKDS/V1-5,08-1_MIDDLE]
X50  FFKDS/V1-5.08_MIDDLE  [FFKDS/V1-5,08-1_MIDDLE]
X51  FFKDS/V1-5.08_MIDDLE  [FFKDS/V1-5,08-1_MIDDLE]
X52  FFKDS/V1-5.08_MIDDLE  [FFKDS/V1-5,08-1_MIDDLE]
X53  FFKDS/V1-5.08_MIDDLE  [FFKDS/V1-5,08-1_MIDDLE]
X54  FFKDS/V1-5.08_MIDDLE  [FFKDS/V1-5,08-1_MIDDLE]
X55  FFKDS/V1-5.08_MIDDLE  [FFKDS/V1-5,08-1_MIDDLE]
X56  FFKDS/V1-5.08_MIDDLE  [FFKDS/V1-5,08-1_MIDDLE]
X57  FFKDS/V1-5.08_MIDDLE  [FFKDS/V1-5,08-1_MIDDLE]
X58  FFKDS/V1-5.08_FIRST  [FFKDS/V1-5,08-1_FIRST]
X59  FFKDS/V1-5.08_MIDDLE  [FFKDS/V1-5,08-1_MIDDLE]
X60  FFKDS/V1-5.08_MIDDLE  [FFKDS/V1-5,08-1_MIDDLE]
X61  FFKDS/V1-5.08_MIDDLE  [FFKDS/V1-5,08-1_MIDDLE]
X62  FFKDS/V1-5.08_MIDDLE  [FFKDS/V1-5,08-1_MIDDLE]
X63  FFKDS/V1-5.08_MIDDLE  [FFKDS/V1-5,08-1_MIDDLE]
X64  FFKDS/V1-5.08_MIDDLE  [FFKDS/V1-5,08-1_MIDDLE]
X65  FFKDS/V1-5.08_MIDDLE  [FFKDS/V1-5,08-1_MIDDLE]
X66  FFKDS/V1-5.08_MIDDLE  [FFKDS/V1-5,08-1_MIDDLE]
X67  FFKDS/V1-5.08_MIDDLE  [FFKDS/V1-5,08-1_MIDDLE]
X68  FFKDS/V1-5.08_MIDDLE  [FFKDS/V1-5,08-1_MIDDLE]
X69  FFKDS/V1-5.08_LAST  [FFKDS/V1-5,08-1_LAST]
X70  FFKDS/V1-5.08_FIRST  [FFKDS/V1-5,08-1_FIRST]
X71  FFKDS/V1-5.08_MIDDLE  [FFKDS/V1-5,08-1_MIDDLE]
X72  FFKDS/V1-5.08_MIDDLE  [FFKDS/V1-5,08-1_MIDDLE]
X73  FFKDS/V1-5.08_MIDDLE  [FFKDS/V1-5,08-1_MIDDLE]
X74  FFKDS/V1-5.08_MIDDLE  [FFKDS/V1-5,08-1_MIDDLE]
X75  FFKDS/V1-5.08_MIDDLE  [FFKDS/V1-5,08-1_MIDDLE]
X76  FFKDS/V1-5.08_MIDDLE  [FFKDS/V1-5,08-1_MIDDLE]
X77  FFKDS/V1-5.08_MIDDLE  [FFKDS/V1-5,08-1_MIDDLE]
X78  FFKDS/V1-5.08_MIDDLE  [FFKDS/V1-5,08-1_MIDDLE]
X79  FFKDS/V1-5.08_MIDDLE  [FFKDS/V1-5,08-1_MIDDLE]
X80  FFKDS/V1-5.08_MIDDLE  [FFKDS/V1-5,08-1_MIDDLE]
X81  FFKDS/V1-5.08_LAST  [FFKDS/V1-5,08-1_LAST]
X82  FFKDS/V1-5.08_MIDDLE  [FFKDS/V1-5,08-1_MIDDLE]
X83  FFKDS/V1-5.08_MIDDLE  [FFKDS/V1-5,08-1_MIDDLE]
X84  FFKDS/V1-5.08_MIDDLE  [FFKDS/V1-5,08-1_MIDDLE]
X85  FFKDS/V1-5.08_MIDDLE  [FFKDS/V1-5,08-1_MIDDLE]
X86  FFKDS/V1-5.08_MIDDLE  [FFKDS/V1-5,08-1_MIDDLE]
X87  FFKDS/V1-5.08_MIDDLE  [FFKDS/V1-5,08-1_MIDDLE]
X88  FFKDS/V1-5.08_FIRST  [FFKDS/V1-5,08-1_FIRST]
X89  FFKDS/V1-5.08_MIDDLE  [FFKDS/V1-5,08-1_MIDDLE]
XT2  FFKDS/V1-5.08-2  [FFKDS/V1-5.08-2]
XT3  FFKDS/V1-5.08-2  [FFKDS/V1-5.08-2]

### Nets
+24V: C122.+ C123.1 D27.A IC14.OUT X58.1@1 X58.2@1 X59.1@1 X59.2@1 X60.1@1 X60.2@1 X61.1@1 X61.2@1 X62.1@1 X62.2@1 X63.1@1 X63.2@1 X64.1@1 X64.2@1 X65.1@1 X65.2@1 X66.1@1 X66.2@1 X67.1@1 X67.2@1 X68.1@1 X68.2@1 X69.1@1 X69.2@1 ; also sheet 2
ADCIN0: C115.1 R170.2 ; also sheet 1
ADCIN1: C116.1 R171.2 ; also sheet 1
ADCIN2: C117.1 R172.2 ; also sheet 1
ADCIN3: C118.1 R173.2 ; also sheet 1
ADCIN4: C132.1 R195.2 ; also sheet 1
ADCIN5: C133.1 R196.2 ; also sheet 1
ADCIN6: C134.1 R197.2 ; also sheet 1
ADCIN7: C135.1 R198.2 ; also sheet 1
ADCIN8: C148.1 R219.2 ; also sheet 1
ADCIN9: C149.1 R220.2 ; also sheet 1
ADCIN10: C150.1 R221.2 ; also sheet 1
ADCIN11: C151.1 R222.2 ; also sheet 1
AGND: C99.2 C100.2 C101.2 C102.- C103.2 C104.- C105.2 C106.2 C107.2 C108.2 C109.2 C114.2 C115.2 C116.2 C117.2 C118.2 C119.2 C120.- C121.2 C122.- C123.2 C124.2 C125.2 C126.2 C127.2 C132.2 C133.2 C134.2 C135.2 C136.2 C137.2 C138.2 C139.2 C140.2 C141.2 C146.2 C147.2 C148.2 C149.2 C150.2 C151.2 DB1.DC-(-) DB2.DC-(-) IC9.2(A) IC10.3(VSS) IC12.11(P:V-) IC13.11(P:V-) IC14.GND IC15.11(P:V-) IC16.11(P:V-) L9.2 R149.2 R150.1 R151.1 R152.1 R153.1 R162.1 R163.1 R164.1 R165.1 R174.2 R175.1 R176.1 R177.1 R178.1 R187.1 R188.1 R189.1 R190.1 R199.1 R200.1 R201.1 R202.1 R211.1 R212.1 R213.1 R214.1 X43.1@1 X43.2@1 X45.1@1 X45.2@1 X47.1@1 X47.2@1 X49.1@1 X49.2@1 X51.1@1 X51.2@1 X53.1@1 X53.2@1 X55.1@1 X55.2@1 X57.1@1 X57.2@1 X70.1@1 X70.2@1 X71.1@1 X71.2@1 X72.1@1 X72.2@1 X73.1@1 X73.2@1 X74.1@1 X74.2@1 X75.1@1 X75.2@1 X76.1@1 X76.2@1 X77.1@1 X77.2@1 X78.1@1 X78.2@1 X79.1@1 X79.2@1 X80.1@1 X80.2@1 X81.1@1 X81.2@1 X83.1@1 X83.2@1 X85.1@1 X85.2@1 X87.1@1 X87.2@1 X89.1@1 X89.2@1 ; also sheet 1
GND: L9.1 ; also sheet 1,2,3
N$49: C99.1 C100.1 IC12.4(P:V+) L8.1 R148.2
N$50: C114.1 C119.1 IC13.4(P:V+) L10.2
N$51: C146.1 C147.1 IC16.4(P:V+) L12.2
N$52: C136.1 C137.1 IC15.4(P:V+) L11.2
N$53: DB1.AC2(A2) XT3.2@1 XT3.2@2
N$54: DB1.AC1(A1) XT3.1@1 XT3.1@2
N$56: DB2.AC2(A2) XT2.2@1 XT2.2@2
N$57: DB2.AC1(A1) XT2.1@1 XT2.1@2
N$81: D23.C R150.2 R154.1
N$83: C106.1 IC13.3(A:+IN) R154.2
N$84: D23.A X42.1@1 X42.2@1
N$87: C110.2 IC13.2(A:-IN) R158.1 R162.2 R166.1
N$88: D24.C R151.2 R155.1
N$113: C102.+ C103.1 D22.C DB2.DC+(+) IC10.1(VIN) R149.1
N$114: C107.1 IC13.5(B:+IN) R155.2
N$115: D24.A X44.1@1 X44.2@1
N$121: C111.2 IC13.6(B:-IN) R159.1 R163.2 R167.1
N$124: D25.C R152.2 R156.1
N$127: C108.1 IC13.10(C:+IN) R156.2
N$128: D25.A X46.1@1 X46.2@1
N$228: C112.2 IC13.9(C:-IN) R160.1 R164.2 R168.2
N$230: C120.+ C121.1 D27.C DB1.DC+(+) IC14.IN R174.1
N$231: D26.C R153.2 R157.1
N$234: C109.1 IC13.12(D:+IN) R157.2
N$235: D26.A X48.1@1 X48.2@1
N$236: C113.2 IC13.13(D:-IN) R161.1 R165.2 R169.2
N$237: C101.1 IC9.1(C) IC12.3(A:+IN) IC12.5(B:+IN) IC12.10(C:+IN) IC12.12(D:+IN) R148.1
N$238: D28.C R175.2 R179.1
N$244: C124.1 IC15.3(A:+IN) R179.2
N$245: D28.A X50.1@1 X50.2@1
N$246: C128.2 IC15.2(A:-IN) R183.1 R187.2 R191.2
N$252: IC12.1(A:OUT) IC12.2(A:-IN) R158.2 R159.2 R160.2 R161.2
N$253: D29.C R176.2 R180.1
N$254: C125.1 IC15.5(B:+IN) R180.2
N$255: D29.A X52.1@1 X52.2@1
N$256: C129.2 IC15.6(B:-IN) R184.1 R188.2 R192.2
N$257: IC12.6(B:-IN) IC12.7(B:OUT) R183.2 R184.2 R185.2 R186.2
N$258: D30.C R177.2 R181.1
N$259: C126.1 IC15.10(C:+IN) R181.2
N$260: D30.A X54.1@1 X54.2@1
N$261: C130.2 IC15.9(C:-IN) R185.1 R189.2 R193.2
N$262: IC12.8(C:OUT) IC12.9(C:-IN) R207.2 R208.2 R209.2 R210.2
N$263: D31.C R178.2 R182.1
N$264: C127.1 IC15.12(D:+IN) R182.2
N$265: D31.A X56.1@1 X56.2@1
N$266: C131.2 IC15.13(D:-IN) R186.1 R190.2 R194.2
N$267: C110.1 IC13.1(A:OUT) R166.2 R170.1
N$268: D32.C R199.2 R203.1
N$269: C138.1 IC16.3(A:+IN) R203.2
N$270: D32.A X82.1@1 X82.2@1
N$271: C142.2 IC16.2(A:-IN) R207.1 R211.2 R215.2
N$272: C128.1 IC15.1(A:OUT) R191.1 R195.1
N$273: D33.C R200.2 R204.1
N$274: C139.1 IC16.5(B:+IN) R204.2
N$275: D33.A X84.1@1 X84.2@1
N$276: C143.2 IC16.6(B:-IN) R208.1 R212.2 R216.1
N$277: C142.1 IC16.1(A:OUT) R215.1 R219.1
N$278: D34.C R201.2 R205.1
N$279: C140.1 IC16.10(C:+IN) R205.2
N$280: D34.A X86.1@1 X86.2@1
N$281: C144.2 IC16.9(C:-IN) R209.1 R213.2 R217.1
N$282: C143.1 IC16.7(B:OUT) R216.2 R220.1
N$283: D35.C R202.2 R206.1
N$284: C141.1 IC16.12(D:+IN) R206.2
N$285: D35.A X88.1@1 X88.2@1
N$286: C145.2 IC16.13(D:-IN) R210.1 R214.2 R218.1
N$287: C144.1 IC16.8(C:OUT) R217.2 R221.1
N$288: C145.1 IC16.14(D:OUT) R218.2 R222.1
N$289: C129.1 IC15.7(B:OUT) R192.1 R196.1
N$290: C130.1 IC15.8(C:OUT) R193.1 R197.1
N$291: C131.1 IC15.14(D:OUT) R194.1 R198.1
N$292: C111.1 IC13.7(B:OUT) R167.2 R171.1
N$293: C112.1 IC13.8(C:OUT) R168.1 R172.1
N$294: C113.1 IC13.14(D:OUT) R169.1 R173.1
VCCA_3V3: C104.+ C105.1 D22.A IC10.2(VOUT) L8.2 L10.1 L11.1 L12.1 ; also sheet 1
VREF_2.5V_ADC: IC12.13(D:-IN) IC12.14(D:OUT) ; also sheet 1
Unconnected: C152.+ C152.- C153.+ C153.- IC9.3(NC)

### Buses
ADCIN[0..11]

### Notes on the sheet
- LM4040AIM3X-2.5
- 温度变送器 PT100 -50~100度  4－20MA  
  杭州雪辰仪表
  https://item.taobao.com/item.htm?spm=a230r.1.14.62.76bf523uB9S1q
- 变压器BK-50VA：
  定制
  输入：380/220V
  输出：24V/1A 独立绕组
        6V/1A 独立绕组
- 24V AC In
- 6V AC In
- 12 路模拟量输入（4～20mA电流环）
- KBE4825(D)
- 1.5A
- KBE4825(D)(自带整流桥的型号)
  初级工作电压：选择220V的
  次级输出电压 24V
  次级空载电压 26.9V
  次级满载电流 625mA
- 自恢复保险 | 1A
- 24V 、0V 端子 为 4-20mA变送器供电。
  每个变送器一对儿端子。
  端子分为上下两排，上24V，下0V

## Sheet 5 of 5: Power Supply
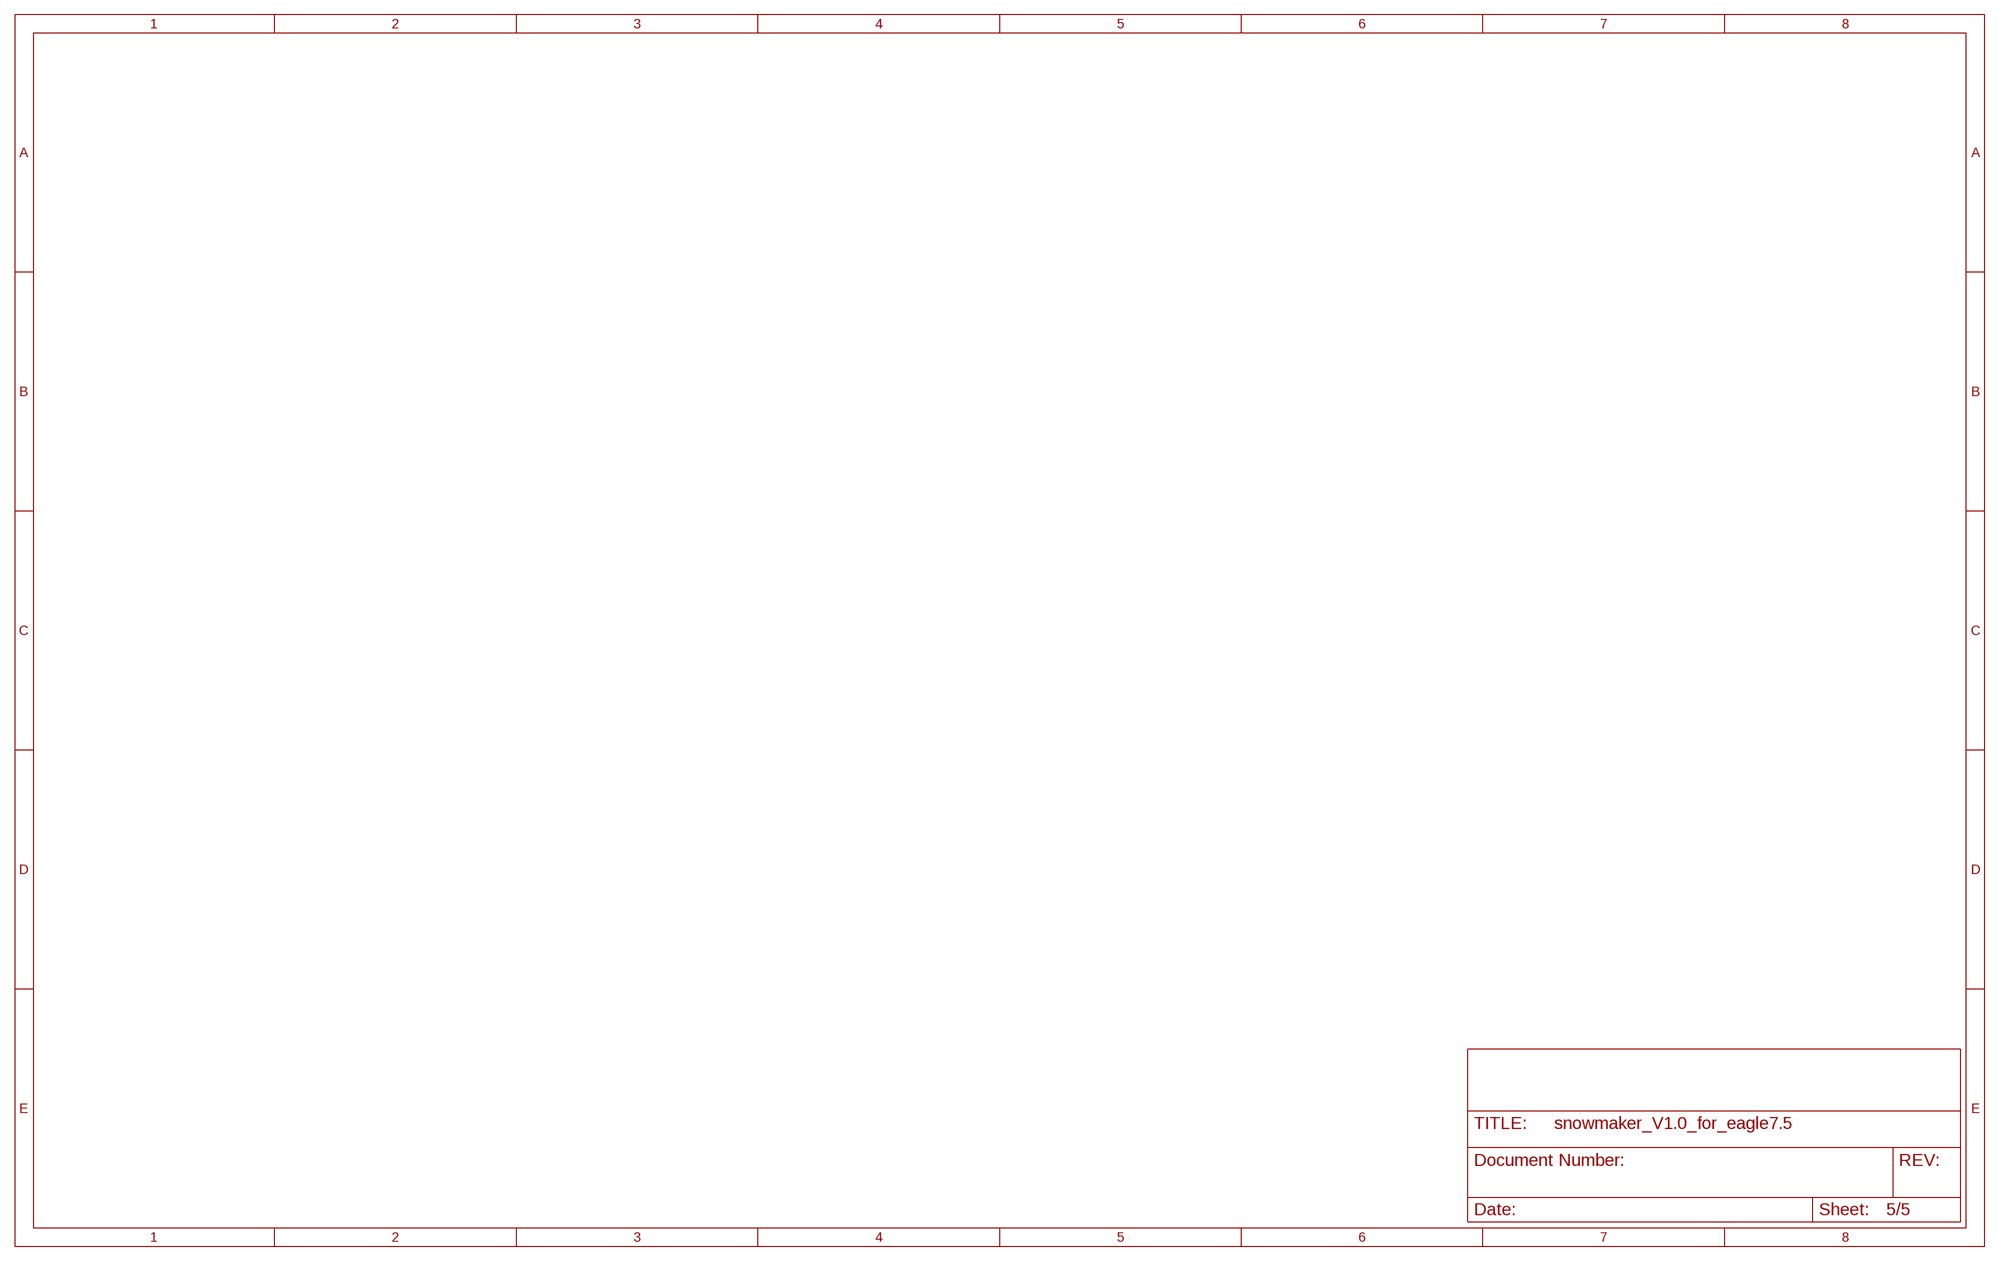
[diagram p10: schematic, sheet 5]

## Library data of the parts
C1-C101 C103 C105-C119 C121 C123-C151 = SHMT:C
C102 C104 C120 C122 C152 C153 = rcl:CPOL-EU: POLARIZED CAPACITOR, European symbol
CON1 = SHMT:HR951180A
CON2 = SHMT:FFKDS/V1-5.08-3
CON3 = SHMT:SWJ
CON4 = SHMT:CON-HARTING-26V: CONNECTOR; OC_FARNELL: unknown; OC_NEWARK: unknown
D1 = SHMT:SM712-02H
D2-D21 D23-D26 D28-D35 = SHMT:1N4148
D22 D27 = SHMT:1N4007
DB1 DB2 = SHMT:KBP*
EC1-EC3 = SHMT:CPOL
G1 = battery:CR2032H: LI BATTERY Varta
IC1 = SHMT:ST3232
IC2 = SHMT:ST3485E
IC3 = prj_snowmaker:W5500
IC4 = prj_snowmaker:SD2068
IC5 = prj_snowmaker:STM32F103VCT6: edit this description Auto generated by make-symbol-device-package-bsdl.ulp Rev. 44 Source:
IC6-IC8 = prj_snowmaker:ULN2803A: DRIVER ARRAY
IC9 = SHMT:LM4040AIM3X-2.5: LM4040AIM3X-2.5
IC10 = SHMT:LM1117IDTX-3.3
IC12 IC13 IC15 IC16 = prj_snowmaker:SGM8584: OP AMP
IC14 = v-reg:78XXS: VOLTAGE REGULATOR
L1-L12 = Seeed-OPL-Inductor:INDUCTOR/FERRITE-BEAD
LED1 LED2 = led:LED: LED OSRAM: - CHIPLED LG R971, LG N971, LY N971, LG Q971, LY Q971, LO R971, LY R971 LH N974, LH R974 LS Q976, LO Q976, LY Q976 LO Q996 - Hyper CHIPLED LW Q18S LB Q993, LB Q99A, LB R99A - SideLED LS A670, LO A670, LY A670, LG A670, LP A670 LB A673, LV A673, LT A673, LW A673 LH A674 LY A675 LS A676, LA A676, LO A676, LY A676, LW A676 LS A679, LY A679, LG A679 - Hyper Micro SIDELED® LS Y876, LA Y876, LO Y876, LY Y876 LT Y87S - SmartLED LW L88C, LW L88S LB L89C, LB L89S, LG L890 LS L89K, LO L89K, LY L89K LS L896, LA L896, LO L896, LY L896 - TOPLED LS T670, LO T670, LY T670, LG T670, LP T670 LSG T670, LSP T670, LSY T670, LOP T670, LYG T670 LG T671, LOG T671, LSG T671 LB T673, LV T673, LT T673, LW T673 LH T674 LS T676, LA T676, LO T676, LY T676, LB T676, LH T676, LSB T676, LW T676 LB T67C, LV T67C, LT T67C, LS T67K, LO T67K, LY T67K, LW E67C LS E67B, LA E67B, LO E67B, LY E67B, LB E67C, LV E67C, LT E67C LW T67C LS T679, LY T679, LG T679 LS T770, LO T770, LY T770, LG T770, LP T770 LB T773, LV T773, LT T773, LW T773 LH T774 LS E675, LA E675, LY E675, LS T675 LS T776, LA T776, LO T776, LY T776, LB T776 LHGB T686 LT T68C, LB T68C - Hyper Mini TOPLED® LB M676 - Mini TOPLED Santana® LG M470 LS M47K, LO M47K, LY M47K Source: http://www.osram.convergy.de LUXEON: - LUMILED® LXK2-PW12-R00, LXK2-PW12-S00, LXK2-PW14-U00, LXK2-PW14-V00 LXK2-PM12-R00, LXK2-PM12-S00, LXK2-PM14-U00 LXK2-PE12-Q00, LXK2-PE12-R00, LXK2-PE12-S00, LXK2-PE14-T00, LXK2-PE14-U00 LXK2-PB12-K00, LXK2-PB12-L00, LXK2-PB12-M00, LXK2-PB14-N00, LXK2-PB14-P00, LXK2-PB14-Q00 LXK2-PR12-L00, LXK2-PR12-M00, LXK2-PR14-Q00, LXK2-PR14-R00 LXK2-PD12-Q00, LXK2-PD12-R00, LXK2-PD12-S00 LXK2-PH12-R00, LXK2-PH12-S00 LXK2-PL12-P00, LXK2-PL12-Q00, LXK2-PL12-R00 Source: www.luxeon.com KINGBRIGHT: KA-3528ASYC Source: www.kingbright.com
LED3 = SHMT:LED
LOGO1 = SHMT:SY-LOGO
OK1-OK11 = prj_snowmaker:TLP283-4: TOSHIBA PHOTOCOUPLER GaAs IRED & PHOTO-TRANSISTOR Source: http://www.semicon.toshiba.co.jp/td/en/Opto/Photocoupler/en_20050928_TLP283_datasheet.pdf
R1-R222 = SHMT:R
U1 = prj_snowmaker:LQ-BTM2540
X1 = con-subd:F09VP: SUB-D; OC_FARNELL: unknown; OC_NEWARK: unknown
X2-X89 = SHMT:FFKDS/V1-5.08
XT1-XT3 = SHMT:FFKDS/V1-5.08-2
XTAL1 XTAL3 = crystal:CRYSTAL: CRYSTAL; OC_FARNELL: unknown; OC_NEWARK: unknown
XTAL2 = prj_snowmaker:MC-306